# EAGLE schematic HW_RPI_DAQ (EAGLE 9.2.1), part 1 of 2

## Sheet 1 of 8: CM5 MODULE
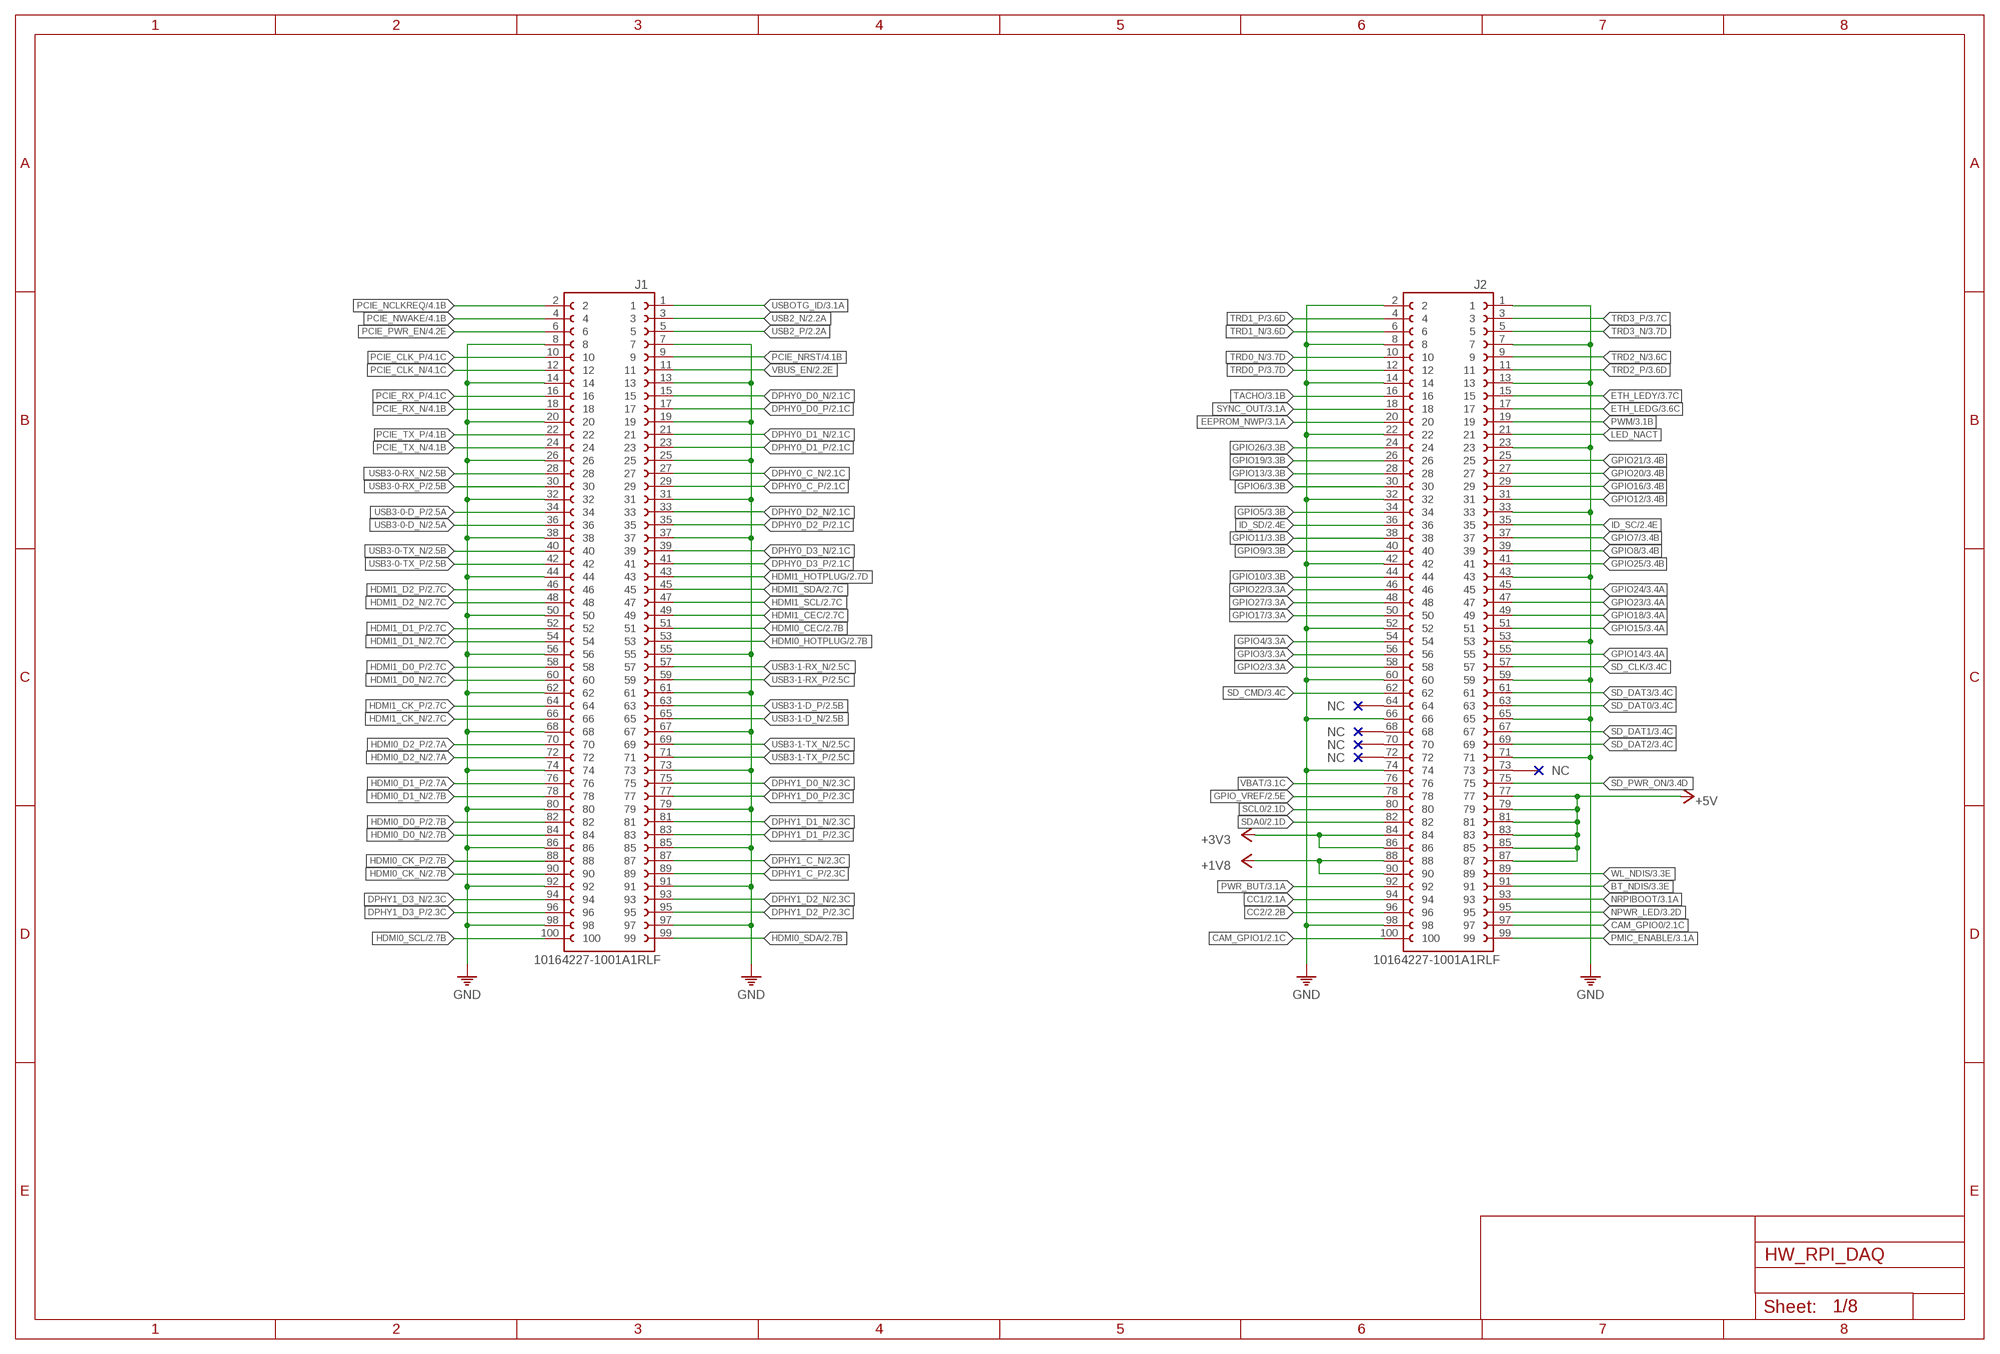
[diagram p0: schematic, sheet 1]

### Parts
J1  10164227-1001A1RLF  [AMPHENOL_10164227-1001A1RLF]
J2  10164227-1001A1RLF  [AMPHENOL_10164227-1001A1RLF]

### Nets
+1V8: J2.88 J2.90 ; also sheet 3
+3V3: J2.84 J2.86 ; also sheet 2,3,4,5,6,7,8
+5V: J2.77 J2.79 J2.81 J2.83 J2.85 J2.87 ; also sheet 2,3,4,7,8
BT_NDIS: J2.91 ; also sheet 3
CAM_GPIO0: J2.97 ; also sheet 2
CAM_GPIO1: J2.100 ; also sheet 2
CC1: J2.94 ; also sheet 2
CC2: J2.96 ; also sheet 2
DPHY0_C_N: J1.27 ; also sheet 2
DPHY0_C_P: J1.29 ; also sheet 2
DPHY0_D0_N: J1.15 ; also sheet 2
DPHY0_D0_P: J1.17 ; also sheet 2
DPHY0_D1_N: J1.21 ; also sheet 2
DPHY0_D1_P: J1.23 ; also sheet 2
DPHY0_D2_N: J1.33 ; also sheet 2
DPHY0_D2_P: J1.35 ; also sheet 2
DPHY0_D3_N: J1.39 ; also sheet 2
DPHY0_D3_P: J1.41 ; also sheet 2
DPHY1_C_N: J1.87 ; also sheet 2
DPHY1_C_P: J1.89 ; also sheet 2
DPHY1_D0_N: J1.75 ; also sheet 2
DPHY1_D0_P: J1.77 ; also sheet 2
DPHY1_D1_N: J1.81 ; also sheet 2
DPHY1_D1_P: J1.83 ; also sheet 2
DPHY1_D2_N: J1.93 ; also sheet 2
DPHY1_D2_P: J1.95 ; also sheet 2
DPHY1_D3_N: J1.94 ; also sheet 2
DPHY1_D3_P: J1.96 ; also sheet 2
EEPROM_NWP: J2.20 ; also sheet 3
ETH_LEDG: J2.17 ; also sheet 3
ETH_LEDY: J2.15 ; also sheet 3
GND: J1.7 J1.8 J1.13 J1.14 J1.19 J1.20 J1.25 J1.26 J1.31 J1.32 J1.37 J1.38 J1.44 J1.50 J1.55 J1.56 J1.61 J1.62 J1.67 J1.68 J1.73 J1.74 J1.79 J1.80 J1.85 J1.86 J1.91 J1.92 J1.97 J1.98 J2.1 J2.2 J2.7 J2.8 J2.13 J2.14 J2.22 J2.23 J2.32 J2.33 J2.42 J2.43 J2.52 J2.53 J2.59 J2.60 J2.65 J2.66 J2.71 J2.74 J2.98 ; also sheet 2,3,4,5,6,7,8
GPIO2: J2.58 ; also sheet 3
GPIO3: J2.56 ; also sheet 3
GPIO4: J2.54 ; also sheet 3,4
GPIO5: J2.34 ; also sheet 3,4
GPIO6: J2.30 ; also sheet 3,4
GPIO7: J2.37 ; also sheet 3,4
GPIO8: J2.39 ; also sheet 3,4
GPIO9: J2.40 ; also sheet 3,4
GPIO10: J2.44 ; also sheet 3,4
GPIO11: J2.38 ; also sheet 3,4
GPIO12: J2.31 ; also sheet 3
GPIO13: J2.28 ; also sheet 3,4
GPIO14: J2.55 ; also sheet 3
GPIO15: J2.51 ; also sheet 3
GPIO16: J2.29 ; also sheet 3,4
GPIO17: J2.50 ; also sheet 3,4
GPIO18: J2.49 ; also sheet 3,4
GPIO19: J2.26 ; also sheet 3,4
GPIO20: J2.27 ; also sheet 3,4
GPIO21: J2.25 ; also sheet 3,4
GPIO22: J2.46 ; also sheet 3
GPIO23: J2.47 ; also sheet 3,4
GPIO24: J2.45 ; also sheet 3,4
GPIO25: J2.41 ; also sheet 3,4
GPIO26: J2.24 ; also sheet 3
GPIO27: J2.48 ; also sheet 3,4
GPIO_VREF: J2.78 ; also sheet 2,3
HDMI0_CEC: J1.51 ; also sheet 2
HDMI0_CK_N [100R_DIFFPAIR]: J1.90 ; also sheet 2
HDMI0_CK_P [100R_DIFFPAIR]: J1.88 ; also sheet 2
HDMI0_D0_N [100R_DIFFPAIR]: J1.84 ; also sheet 2
HDMI0_D0_P [100R_DIFFPAIR]: J1.82 ; also sheet 2
HDMI0_D1_N [100R_DIFFPAIR]: J1.78 ; also sheet 2
HDMI0_D1_P [100R_DIFFPAIR]: J1.76 ; also sheet 2
HDMI0_D2_N [100R_DIFFPAIR]: J1.72 ; also sheet 2
HDMI0_D2_P [100R_DIFFPAIR]: J1.70 ; also sheet 2
HDMI0_HOTPLUG: J1.53 ; also sheet 2
HDMI0_SCL: J1.100 ; also sheet 2
HDMI0_SDA: J1.99 ; also sheet 2
HDMI1_CEC: J1.49 ; also sheet 2
HDMI1_CK_N [100R_DIFFPAIR]: J1.66 ; also sheet 2
HDMI1_CK_P [100R_DIFFPAIR]: J1.64 ; also sheet 2
HDMI1_D0_N [100R_DIFFPAIR]: J1.60 ; also sheet 2
HDMI1_D0_P [100R_DIFFPAIR]: J1.58 ; also sheet 2
HDMI1_D1_N [100R_DIFFPAIR]: J1.54 ; also sheet 2
HDMI1_D1_P [100R_DIFFPAIR]: J1.52 ; also sheet 2
HDMI1_D2_N [100R_DIFFPAIR]: J1.48 ; also sheet 2
HDMI1_D2_P [100R_DIFFPAIR]: J1.46 ; also sheet 2
HDMI1_HOTPLUG: J1.43 ; also sheet 2
HDMI1_SCL: J1.47 ; also sheet 2
HDMI1_SDA: J1.45 ; also sheet 2
ID_SC: J2.35 ; also sheet 2,3
ID_SD: J2.36 ; also sheet 2,3
LED_NACT: J2.21
NPWR_LED: J2.95 ; also sheet 3
NRPIBOOT: J2.93 ; also sheet 3
PCIE_CLK_N: J1.12 ; also sheet 4
PCIE_CLK_P: J1.10 ; also sheet 4
PCIE_NCLKREQ: J1.2 ; also sheet 4
PCIE_NRST: J1.9 ; also sheet 4
PCIE_NWAKE: J1.4 ; also sheet 4
PCIE_PWR_EN: J1.6 ; also sheet 4
PCIE_RX_N: J1.18 ; also sheet 4
PCIE_RX_P: J1.16 ; also sheet 4
PCIE_TX_N: J1.24 ; also sheet 4
PCIE_TX_P: J1.22 ; also sheet 4
PMIC_ENABLE: J2.99 ; also sheet 3
PWM: J2.19 ; also sheet 3
PWR_BUT: J2.92 ; also sheet 3
SCL0: J2.80 ; also sheet 2
SD_CLK: J2.57 ; also sheet 3
SD_CMD: J2.62 ; also sheet 3
SD_DAT0: J2.63 ; also sheet 3
SD_DAT1: J2.67 ; also sheet 3
SD_DAT2: J2.69 ; also sheet 3
SD_DAT3: J2.61 ; also sheet 3
SD_PWR_ON: J2.75 ; also sheet 3
SDA0: J2.82 ; also sheet 2
SYNC_OUT: J2.18 ; also sheet 3
TACHO: J2.16 ; also sheet 3
TRD0_N [100R_DIFFPAIR]: J2.10 ; also sheet 3
TRD0_P [100R_DIFFPAIR]: J2.12 ; also sheet 3
TRD1_N [100R_DIFFPAIR]: J2.6 ; also sheet 3
TRD1_P [100R_DIFFPAIR]: J2.4 ; also sheet 3
TRD2_N [100R_DIFFPAIR]: J2.9 ; also sheet 3
TRD2_P [100R_DIFFPAIR]: J2.11 ; also sheet 3
TRD3_N [100R_DIFFPAIR]: J2.5 ; also sheet 3
TRD3_P [100R_DIFFPAIR]: J2.3 ; also sheet 3
USB2_N [90R_DIFFPAIR]: J1.3 ; also sheet 2
USB2_P [90R_DIFFPAIR]: J1.5 ; also sheet 2
USB3-0-D_N [90R_DIFFPAIR]: J1.36 ; also sheet 2
USB3-0-D_P [90R_DIFFPAIR]: J1.34 ; also sheet 2
USB3-0-RX_N [90R_DIFFPAIR]: J1.28 ; also sheet 2
USB3-0-RX_P [90R_DIFFPAIR]: J1.30 ; also sheet 2
USB3-0-TX_N [90R_DIFFPAIR]: J1.40 ; also sheet 2
USB3-0-TX_P [90R_DIFFPAIR]: J1.42 ; also sheet 2
USB3-1-D_N [90R_DIFFPAIR]: J1.65 ; also sheet 2
USB3-1-D_P [90R_DIFFPAIR]: J1.63 ; also sheet 2
USB3-1-RX_N [90R_DIFFPAIR]: J1.57 ; also sheet 2
USB3-1-RX_P [90R_DIFFPAIR]: J1.59 ; also sheet 2
USB3-1-TX_N [90R_DIFFPAIR]: J1.69 ; also sheet 2
USB3-1-TX_P [90R_DIFFPAIR]: J1.71 ; also sheet 2
USBOTG_ID: J1.1 ; also sheet 3
VBAT: J2.76 ; also sheet 3
VBUS_EN: J1.11 ; also sheet 2
WL_NDIS: J2.89 ; also sheet 3
Unconnected: J2.64 J2.68 J2.70 J2.72 J2.73

## Sheet 2 of 8: CM5 HIGH SPEED INTERFACES
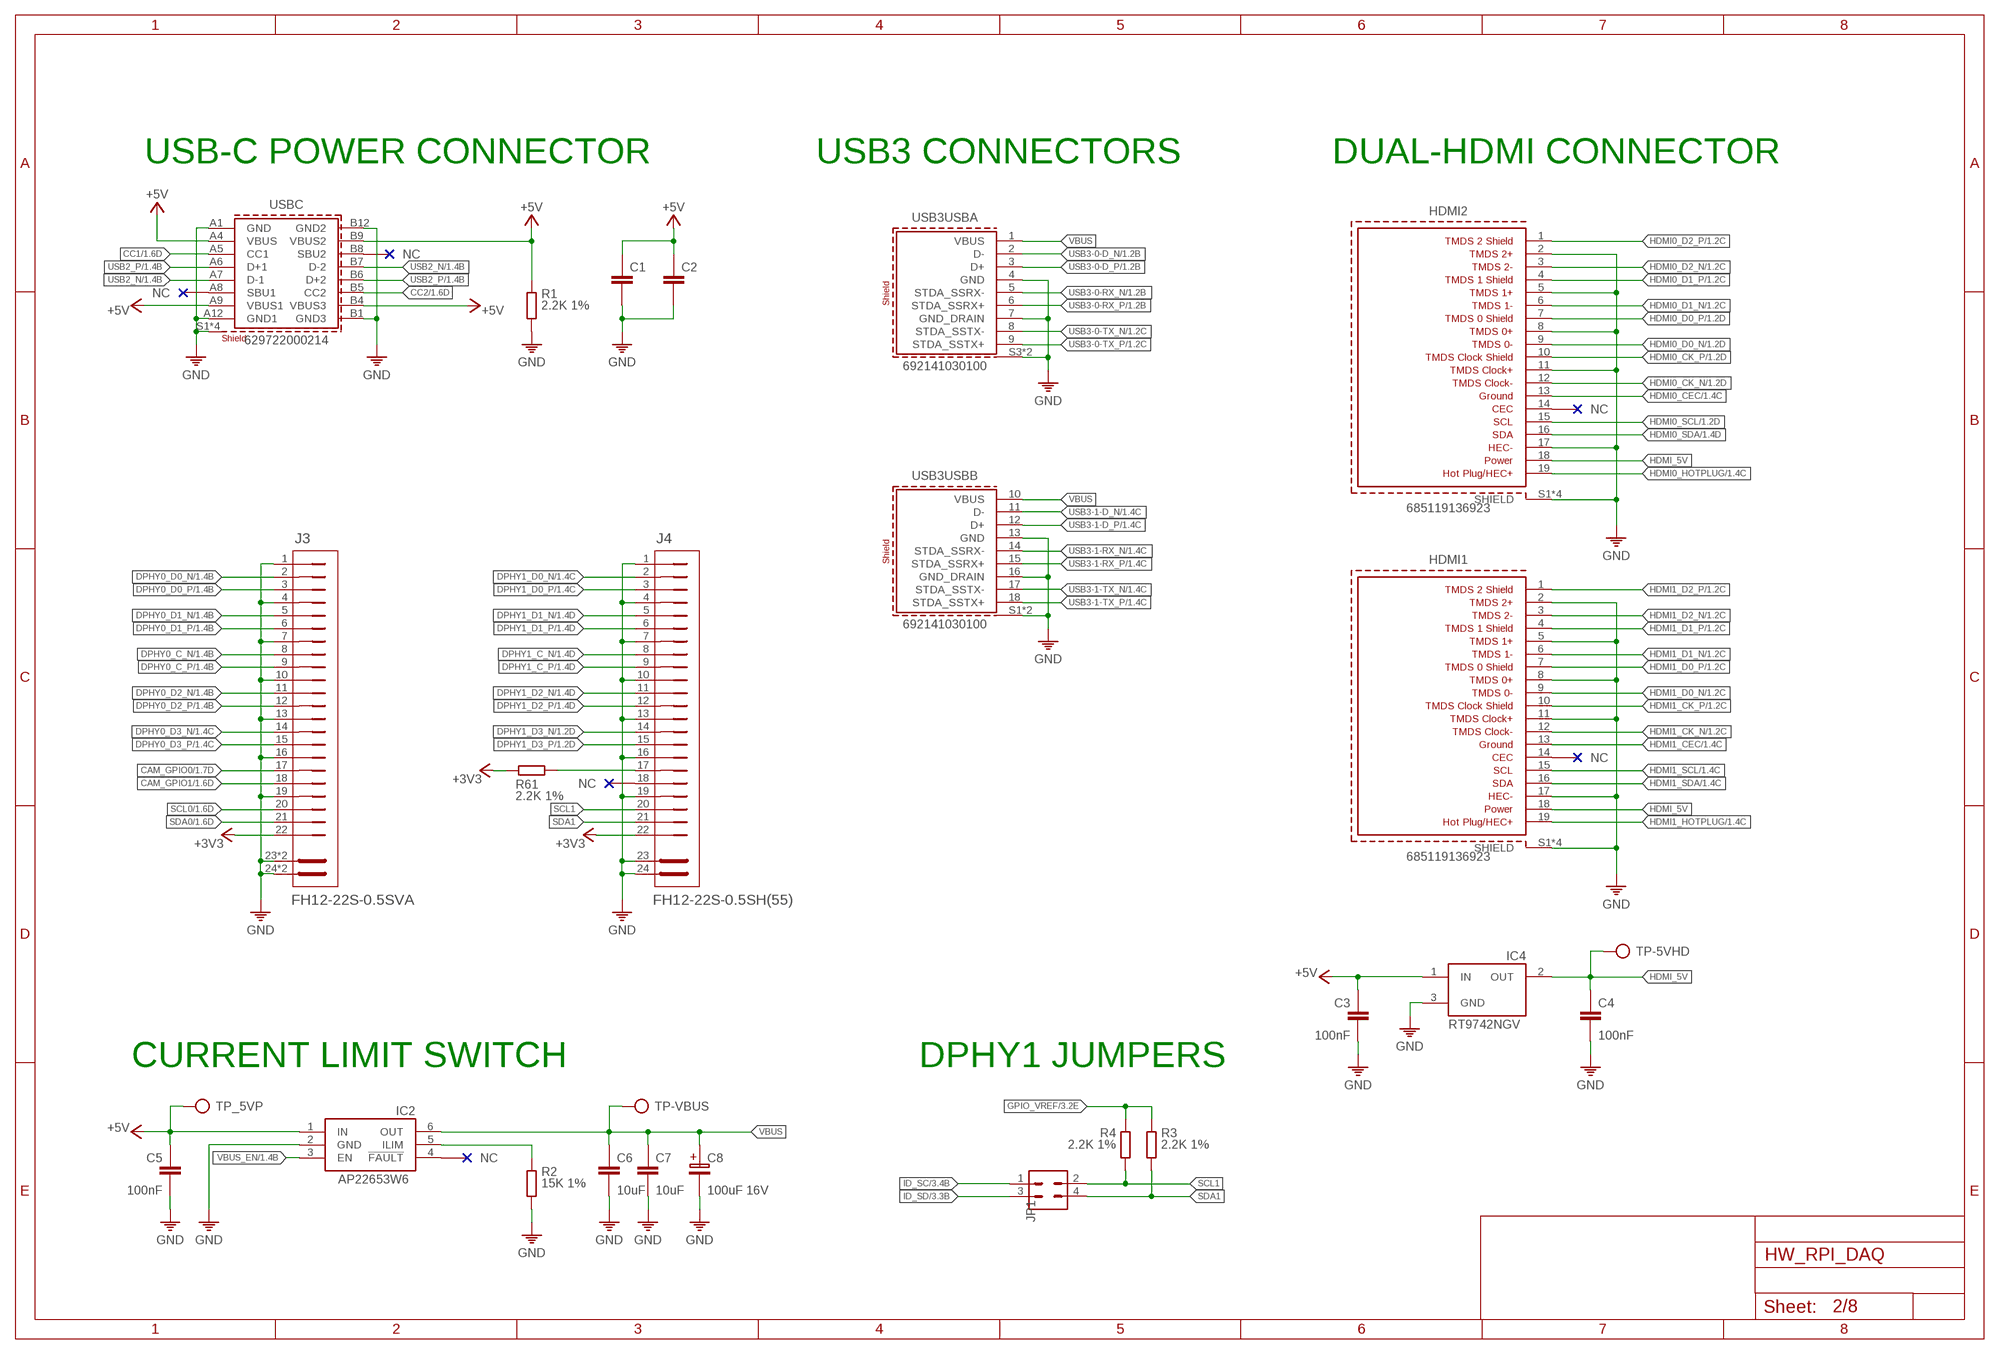
[diagram p1: schematic, sheet 2]

### Parts
C1  C0402  [0402]
C2  C0402  [0402]
C3  100nF  C0402  [0402]
C4  100nF  C0402  [0402]
C5  100nF  C0402  [0402]
C6  10uF  C0805  [0805]
C7  10uF  C0805  [0805]
C8  100uF 16V  CPOL  [100UF-16V]
HDMI1  685119136923  [685119136923]
HDMI2  685119136923  [685119136923]
IC2  AP22653W6  [SOT23-6]
IC4  RT9742NGV  [SOT23]
J3  FH12-22S-0.5SVA  [FH12-22S-0.5SH]
J4  FH12-22S-0.5SH(55)  [CONN_FH12-22S-0.5SH(55)_HIR]
JP1  CON-2X2  [2X2]
R1  2.2K 1%  R0402  [0402]
R2  15K 1%  R0402  [0402]
R3  2.2K 1%  R0402  [0402]
R4  2.2K 1%  R0402  [0402]
R61  2.2K 1%  R0402  [0402]
TP-5VHD  TP  [TP]
TP-VBUS  TP  [TP]
TP_5VP  TP  [TP]
USB3  692141030100  [692141030100]
USBC  629722000214  [629722000214]

### Nets
+3V3: J3.22 J4.22 R61.2 ; also sheet 1,3,4,5,6,7,8
+5V: C1.1 C2.1 C3.1 C5.1 IC2.1(IN) IC4.1(IN) R1.1 TP_5VP.TP USBC.A4(VBUS) USBC.A9(VBUS1) USBC.B4(VBUS3) USBC.B9(VBUS2) ; also sheet 1,3,4,7,8
CAM_GPIO0: J3.17 ; also sheet 1
CAM_GPIO1: J3.18 ; also sheet 1
CC1: USBC.A5(CC1) ; also sheet 1
CC2: USBC.B5(CC2) ; also sheet 1
DPHY0_C_N: J3.8 ; also sheet 1
DPHY0_C_P: J3.9 ; also sheet 1
DPHY0_D0_N: J3.2 ; also sheet 1
DPHY0_D0_P: J3.3 ; also sheet 1
DPHY0_D1_N: J3.5 ; also sheet 1
DPHY0_D1_P: J3.6 ; also sheet 1
DPHY0_D2_N: J3.11 ; also sheet 1
DPHY0_D2_P: J3.12 ; also sheet 1
DPHY0_D3_N: J3.14 ; also sheet 1
DPHY0_D3_P: J3.15 ; also sheet 1
DPHY1_C_N: J4.8 ; also sheet 1
DPHY1_C_P: J4.9 ; also sheet 1
DPHY1_D0_N: J4.2 ; also sheet 1
DPHY1_D0_P: J4.3 ; also sheet 1
DPHY1_D1_N: J4.5 ; also sheet 1
DPHY1_D1_P: J4.6 ; also sheet 1
DPHY1_D2_N: J4.11 ; also sheet 1
DPHY1_D2_P: J4.12 ; also sheet 1
DPHY1_D3_N: J4.14 ; also sheet 1
DPHY1_D3_P: J4.15 ; also sheet 1
GND: C1.2 C2.2 C3.2 C4.2 C5.2 C6.2 C7.2 C8.2 HDMI1.2(TMDS2+) HDMI1.5(TMDSDATA1+) HDMI1.8(TMDS0+) HDMI1.11(TMDSCLOCK+) HDMI1.17(UTILITY/HEAC+) HDMI1.S1(SHIELD) HDMI1.S2(SHIELD) HDMI1.S3(SHIELD) HDMI1.S4(SHIELD) HDMI2.2(TMDS2+) HDMI2.5(TMDSDATA1+) HDMI2.8(TMDS0+) HDMI2.11(TMDSCLOCK+) HDMI2.17(UTILITY/HEAC+) HDMI2.S1(SHIELD) HDMI2.S2(SHIELD) HDMI2.S3(SHIELD) HDMI2.S4(SHIELD) IC2.2(GND) IC4.3(GND) J3.1 J3.4 J3.7 J3.10 J3.13 J3.16 J3.19 J3.23(MH1) J3.24(MH2) J3.25(MH1) J3.26(MH2) J4.1 J4.4 J4.7 J4.10 J4.13 J4.16 J4.19 J4.23(MH1) J4.24(MH2) R1.2 R2.2 USB3.4(USBA:GND) USB3.7(USBA:GND_DRAIN) USB3.13(USBB:GND) USB3.16(USBB:GND_DRAIN) USB3.S1(USBB:SHIELD) USB3.S2(USBB:SHIELD) USB3.S3(USBA:SHIELD) USB3.S4(USBA:SHIELD) USBC.A1(GND) USBC.A12(GND1) USBC.B1(GND3) USBC.B12(GND2) USBC.S1(SHIELD) USBC.S2(SHIELD) USBC.S3(SHIELD) USBC.S4(SHIELD) ; also sheet 1,3,4,5,6,7,8
GPIO_VREF: R3.1 R4.1 ; also sheet 1,3
HDMI0_CEC: HDMI2.13(GROUND) ; also sheet 1
HDMI0_CK_N [100R_DIFFPAIR]: HDMI2.12(TMDSCLOCK-) ; also sheet 1
HDMI0_CK_P [100R_DIFFPAIR]: HDMI2.10(TMDSCLOCKSHIELD) ; also sheet 1
HDMI0_D0_N [100R_DIFFPAIR]: HDMI2.9(TMDS0-) ; also sheet 1
HDMI0_D0_P [100R_DIFFPAIR]: HDMI2.7(TMDS0SHIELD) ; also sheet 1
HDMI0_D1_N [100R_DIFFPAIR]: HDMI2.6(TMDS1-) ; also sheet 1
HDMI0_D1_P [100R_DIFFPAIR]: HDMI2.4(TMDS1SHIELD) ; also sheet 1
HDMI0_D2_N [100R_DIFFPAIR]: HDMI2.3(TMDS2-) ; also sheet 1
HDMI0_D2_P [100R_DIFFPAIR]: HDMI2.1(TMDS2SHIELD) ; also sheet 1
HDMI0_HOTPLUG: HDMI2.19(HOTPLUG/HEC+) ; also sheet 1
HDMI0_SCL: HDMI2.15(SCL) ; also sheet 1
HDMI0_SDA: HDMI2.16(SDA) ; also sheet 1
HDMI1_CEC: HDMI1.13(GROUND) ; also sheet 1
HDMI1_CK_N [100R_DIFFPAIR]: HDMI1.12(TMDSCLOCK-) ; also sheet 1
HDMI1_CK_P [100R_DIFFPAIR]: HDMI1.10(TMDSCLOCKSHIELD) ; also sheet 1
HDMI1_D0_N [100R_DIFFPAIR]: HDMI1.9(TMDS0-) ; also sheet 1
HDMI1_D0_P [100R_DIFFPAIR]: HDMI1.7(TMDS0SHIELD) ; also sheet 1
HDMI1_D1_N [100R_DIFFPAIR]: HDMI1.6(TMDS1-) ; also sheet 1
HDMI1_D1_P [100R_DIFFPAIR]: HDMI1.4(TMDS1SHIELD) ; also sheet 1
HDMI1_D2_N [100R_DIFFPAIR]: HDMI1.3(TMDS2-) ; also sheet 1
HDMI1_D2_P [100R_DIFFPAIR]: HDMI1.1(TMDS2SHIELD) ; also sheet 1
HDMI1_HOTPLUG: HDMI1.19(HOTPLUG/HEC+) ; also sheet 1
HDMI1_SCL: HDMI1.15(SCL) ; also sheet 1
HDMI1_SDA: HDMI1.16(SDA) ; also sheet 1
HDMI_5V: C4.1 HDMI1.18(POWER) HDMI2.18(POWER) IC4.2(OUT) TP-5VHD.TP
ID_SC: JP1.1 ; also sheet 1,3
ID_SD: JP1.3 ; also sheet 1,3
N$1: IC2.5(ILIM) R2.1
N$45: J4.17 R61.1
SCL0: J3.20 ; also sheet 1
SCL1: J4.20 JP1.2 R4.2
SDA0: J3.21 ; also sheet 1
SDA1: J4.21 JP1.4 R3.2
USB2_N [90R_DIFFPAIR]: USBC.A7(D-1) USBC.B7(D-2) ; also sheet 1
USB2_P [90R_DIFFPAIR]: USBC.A6(D+1) USBC.B6(D+2) ; also sheet 1
USB3-0-D_N [90R_DIFFPAIR]: USB3.2(USBA:D-) ; also sheet 1
USB3-0-D_P [90R_DIFFPAIR]: USB3.3(USBA:D+) ; also sheet 1
USB3-0-RX_N [90R_DIFFPAIR]: USB3.5(USBA:STDA_SSRX-) ; also sheet 1
USB3-0-RX_P [90R_DIFFPAIR]: USB3.6(USBA:STDA_SSRX+) ; also sheet 1
USB3-0-TX_N [90R_DIFFPAIR]: USB3.8(USBA:STDA_SSTX-) ; also sheet 1
USB3-0-TX_P [90R_DIFFPAIR]: USB3.9(USBA:STDA_SSTX+) ; also sheet 1
USB3-1-D_N [90R_DIFFPAIR]: USB3.11(USBB:D-) ; also sheet 1
USB3-1-D_P [90R_DIFFPAIR]: USB3.12(USBB:D+) ; also sheet 1
USB3-1-RX_N [90R_DIFFPAIR]: USB3.14(USBB:STDA_SSRX-) ; also sheet 1
USB3-1-RX_P [90R_DIFFPAIR]: USB3.15(USBB:STDA_SSRX+) ; also sheet 1
USB3-1-TX_N [90R_DIFFPAIR]: USB3.17(USBB:STDA_SSTX-) ; also sheet 1
USB3-1-TX_P [90R_DIFFPAIR]: USB3.18(USBB:STDA_SSTX+) ; also sheet 1
VBUS: C6.1 C7.1 C8.1 IC2.6(OUT) TP-VBUS.TP USB3.1(USBA:VBUS) USB3.10(USBB:VBUS)
VBUS_EN: IC2.3(EN) ; also sheet 1
Unconnected: HDMI1.14(CEC) HDMI2.14(CEC) IC2.4(!FAULT) J4.18 USBC.A8(SBU1) USBC.B8(SBU2)

### Notes on the sheet
- USB-C POWER CONNECTOR | USB3 CONNECTORS | DUAL-HDMI CONNECTOR
- CURRENT LIMIT SWITCH | DPHY1 JUMPERS

## Sheet 3 of 8: CM5 GPIO INTERFACES, ETHERNET
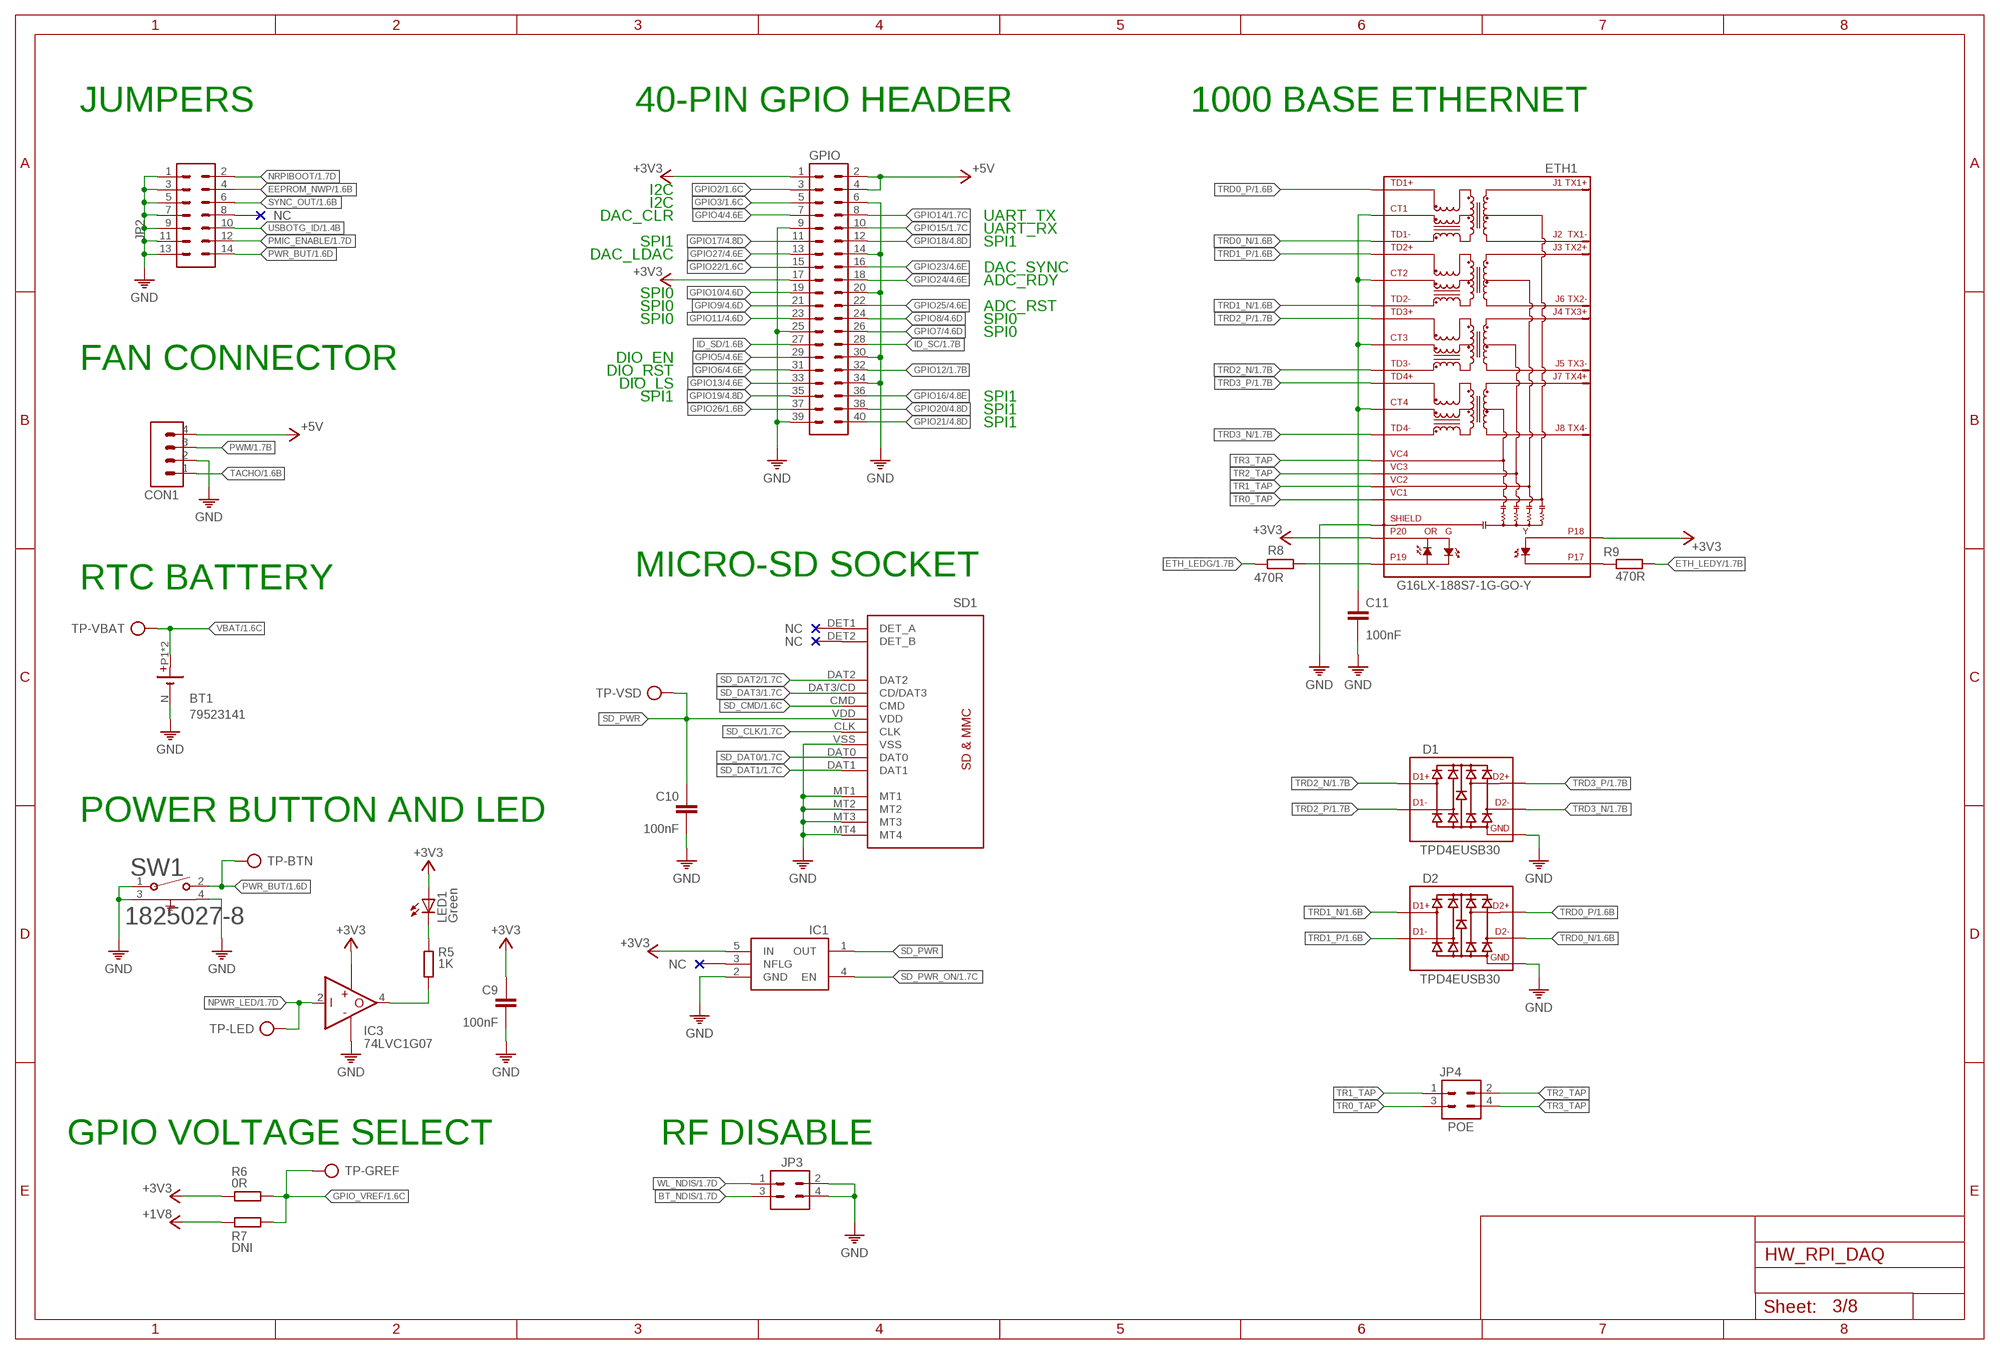
[diagram p2: schematic, sheet 3]

### Parts
BT1  79523141  [79523141]
C9  100nF  C0402  [0402]
C10  100nF  C0402  [0402]
C11  100nF  C0402  [0402]
CON1  CON-1X4  [1X4]
D1  TPD4EUSB30  [USON]
D2  TPD4EUSB30  [USON]
ETH1  G16LX-188S7-1G-GO-Y  MAGJACK-POE  [MAGJACK_POE]
GPIO  CON-2X20  [2X20]
IC1  RT9742GGJ5  [SOT23-5]
IC3  74LVC1G07  [SOT23-5]
JP2  CON-2X7  [2X7]
JP3  CON-2X2  [2X2]
JP4  POE  CON-2X2  [2X2]
LED1  Green  LEDCHIPLED_0805  [CHIPLED_0805]
R5  1K  R0402  [0402]
R6  0R  R0402  [0402]
R7  DNI  R0402  [0402]
R8  470R  R0402  [0402]
R9  470R  R0402  [0402]
SD1  MICRO-SD  [MICROSD]
SW1  1825027-8  [SW2_1825027-C_TEC]
TP-BTN  TP  [TP]
TP-GREF  TP  [TP]
TP-LED  TP  [TP]
TP-VBAT  TP  [TP]
TP-VSD  TP  [TP]

### Nets
+1V8: R7.1 ; also sheet 1
+3V3: C9.1 ETH1.18 ETH1.20 GPIO.1 GPIO.17 IC1.5(IN) IC3.5(VCC) LED1.A R6.1 ; also sheet 1,2,4,5,6,7,8
+5V: CON1.4 GPIO.2 GPIO.4 ; also sheet 1,2,4,7,8
BT_NDIS: JP3.3 ; also sheet 1
EEPROM_NWP: JP2.4 ; also sheet 1
ETH_LEDG: R8.1 ; also sheet 1
ETH_LEDY: R9.2 ; also sheet 1
GND: BT1.N(-) C9.2 C10.2 C11.2 CON1.2 D1.3(GND) D1.8(GND) D2.3(GND) D2.8(GND) ETH1.MH3(SHIELD) ETH1.MH4(SHIELD) GPIO.6 GPIO.9 GPIO.14 GPIO.20 GPIO.25 GPIO.30 GPIO.34 GPIO.39 IC1.2(GND) IC3.3(GND) JP2.1 JP2.3 JP2.5 JP2.7 JP2.9 JP2.11 JP2.13 JP3.2 JP3.4 SD1.MT1 SD1.MT2 SD1.MT3 SD1.MT4 SD1.VSS SW1.1 SW1.3 SW1.4 ; also sheet 1,2,4,5,6,7,8
GPIO2: GPIO.3 ; also sheet 1
GPIO3: GPIO.5 ; also sheet 1
GPIO4: GPIO.7 ; also sheet 1,4
GPIO5: GPIO.29 ; also sheet 1,4
GPIO6: GPIO.31 ; also sheet 1,4
GPIO7: GPIO.26 ; also sheet 1,4
GPIO8: GPIO.24 ; also sheet 1,4
GPIO9: GPIO.21 ; also sheet 1,4
GPIO10: GPIO.19 ; also sheet 1,4
GPIO11: GPIO.23 ; also sheet 1,4
GPIO12: GPIO.32 ; also sheet 1
GPIO13: GPIO.33 ; also sheet 1,4
GPIO14: GPIO.8 ; also sheet 1
GPIO15: GPIO.10 ; also sheet 1
GPIO16: GPIO.36 ; also sheet 1,4
GPIO17: GPIO.11 ; also sheet 1,4
GPIO18: GPIO.12 ; also sheet 1,4
GPIO19: GPIO.35 ; also sheet 1,4
GPIO20: GPIO.38 ; also sheet 1,4
GPIO21: GPIO.40 ; also sheet 1,4
GPIO22: GPIO.15 ; also sheet 1
GPIO23: GPIO.16 ; also sheet 1,4
GPIO24: GPIO.18 ; also sheet 1,4
GPIO25: GPIO.22 ; also sheet 1,4
GPIO26: GPIO.37 ; also sheet 1
GPIO27: GPIO.13 ; also sheet 1,4
GPIO_VREF: R6.2 R7.2 TP-GREF.TP ; also sheet 1,2
ID_SC: GPIO.28 ; also sheet 1,2
ID_SD: GPIO.27 ; also sheet 1,2
N$2: LED1.C R5.1
N$3: IC3.4(Y) R5.2
N$4: C11.1 ETH1.CT1 ETH1.CT2 ETH1.CT3 ETH1.CT4
N$5: ETH1.17 R9.1
N$8: ETH1.19 R8.2
NPWR_LED: IC3.2(A) TP-LED.TP ; also sheet 1
NRPIBOOT: JP2.2 ; also sheet 1
PMIC_ENABLE: JP2.12 ; also sheet 1
PWM: CON1.3 ; also sheet 1
PWR_BUT: JP2.14 SW1.2 TP-BTN.TP ; also sheet 1
SD_CLK: SD1.CLK ; also sheet 1
SD_CMD: SD1.CMD ; also sheet 1
SD_DAT0: SD1.DAT0 ; also sheet 1
SD_DAT1: SD1.DAT1 ; also sheet 1
SD_DAT2: SD1.DAT2 ; also sheet 1
SD_DAT3: SD1.DAT3/CD(CD/DAT3) ; also sheet 1
SD_PWR: C10.1 IC1.1(OUT) SD1.VDD TP-VSD.TP
SD_PWR_ON: IC1.4(EN) ; also sheet 1
SYNC_OUT: JP2.6 ; also sheet 1
TACHO: CON1.1 ; also sheet 1
TR0_TAP: ETH1.VC1 JP4.3
TR1_TAP: ETH1.VC2 JP4.1
TR2_TAP: ETH1.VC3 JP4.2
TR3_TAP: ETH1.VC4 JP4.4
TRD0_N [100R_DIFFPAIR]: D2.2(D1-) D2.9(D1-) ETH1.TD1- ; also sheet 1
TRD0_P [100R_DIFFPAIR]: D2.1(D1+) D2.10(D1+) ETH1.TD1+ ; also sheet 1
TRD1_N [100R_DIFFPAIR]: D2.4(D2+) D2.7(D2+) ETH1.TD2- ; also sheet 1
TRD1_P [100R_DIFFPAIR]: D2.5(D2-) D2.6(D2-) ETH1.TD2+ ; also sheet 1
TRD2_N [100R_DIFFPAIR]: D1.4(D2+) D1.7(D2+) ETH1.TD3- ; also sheet 1
TRD2_P [100R_DIFFPAIR]: D1.5(D2-) D1.6(D2-) ETH1.TD3+ ; also sheet 1
TRD3_N [100R_DIFFPAIR]: D1.2(D1-) D1.9(D1-) ETH1.TD4- ; also sheet 1
TRD3_P [100R_DIFFPAIR]: D1.1(D1+) D1.10(D1+) ETH1.TD4+ ; also sheet 1
USBOTG_ID: JP2.10 ; also sheet 1
VBAT: BT1.P1(+) BT1.P2(+) TP-VBAT.TP ; also sheet 1
WL_NDIS: JP3.1 ; also sheet 1
Unconnected: IC1.3(NFLG) JP2.8 SD1.DET1(DET_A) SD1.DET2(DET_B)

### Notes on the sheet
- JUMPERS | 40-PIN GPIO HEADER | 1000 BASE ETHERNET
- I2C
- I2C
- DAC_CLR | UART_TX
- UART_RX
- SPI1 | SPI1
- DAC_LDAC
- DAC_SYNC
- ADC_RDY
- SPI0
- SPI0 | ADC_RST
- SPI0 | SPI0
- SPI0
- DIO_EN
- FAN CONNECTOR | DIO_RST
- DIO_LS
- SPI1 | SPI1
- SPI1
- SPI1
- MICRO-SD SOCKET
- RTC BATTERY
- POWER BUTTON AND LED
- GPIO VOLTAGE SELECT | RF DISABLE

## Sheet 4 of 8: CM5 PCIE-M2 INTERFACE
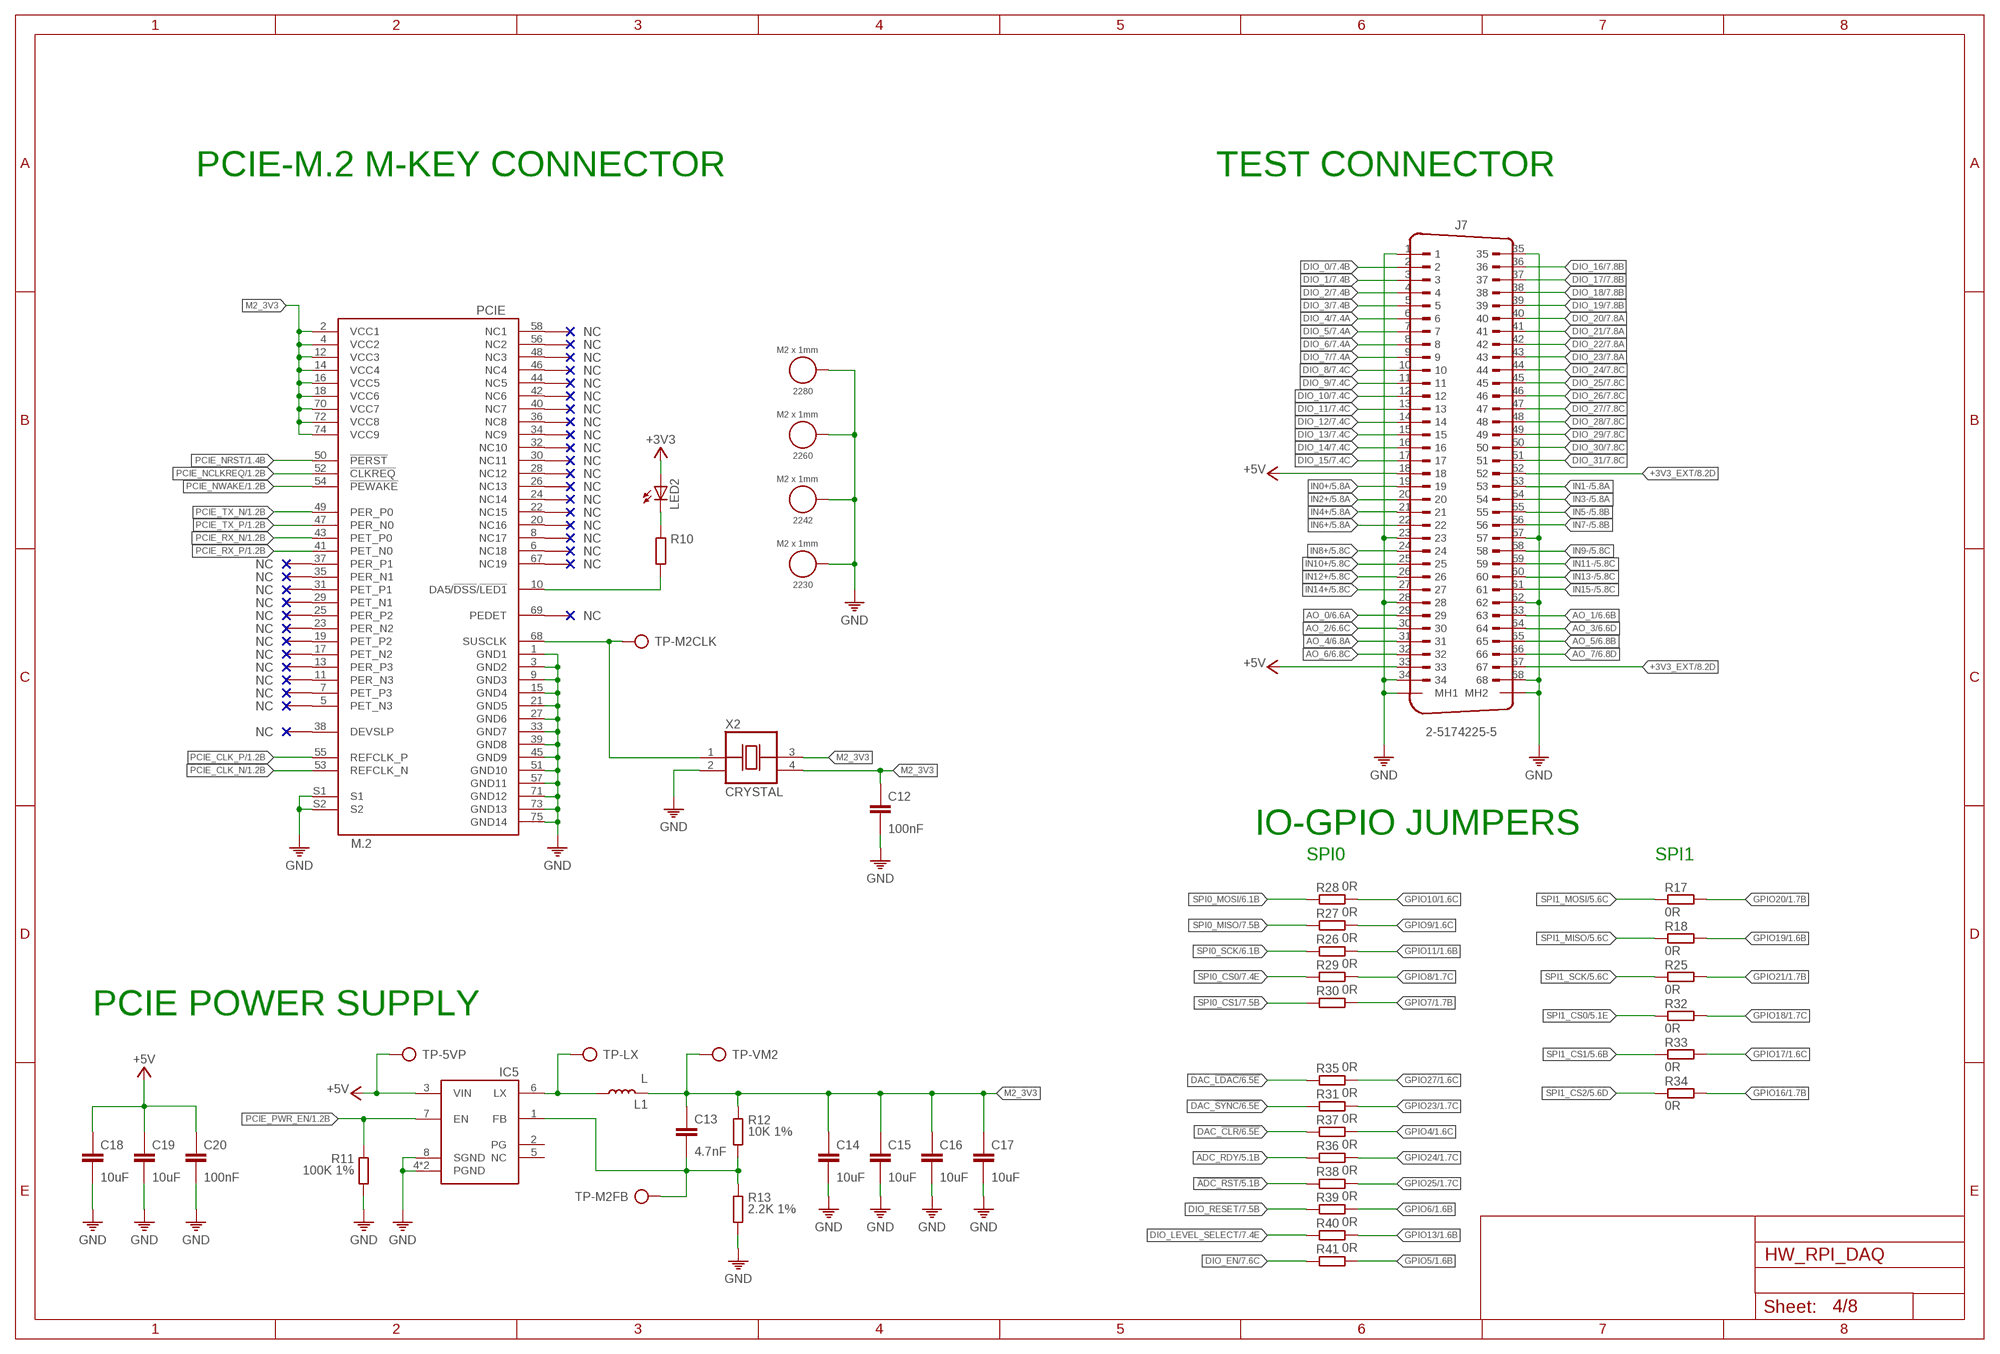
[diagram p3: schematic, sheet 4]

### Parts
2230  M2 x 1mm  WA-SMSI_9774XXX243_9774010243  [WA-SMSI_9774010243]
2242  M2 x 1mm  WA-SMSI_9774XXX243_9774010243  [WA-SMSI_9774010243]
2260  M2 x 1mm  WA-SMSI_9774XXX243_9774010243  [WA-SMSI_9774010243]
2280  M2 x 1mm  WA-SMSI_9774XXX243_9774010243  [WA-SMSI_9774010243]
C12  100nF  C0402  [0402]
C13  4.7nF  C0402  [0402]
C14  10uF  C0805  [0805]
C15  10uF  C0805  [0805]
C16  10uF  C0805  [0805]
C17  10uF  C0805  [0805]
C18  10uF  C0805  [0805]
C19  10uF  C0805  [0805]
C20  100nF  C0402  [0402]
IC5  AP3441SHE-7B  [SON50P201X201X56-9T90X170N]
J7  2-5174225-5  [2-5174225-5]
L1  L  [SRR5228A]
LED2  LEDCHIPLED_0805  [CHIPLED_0805]
PCIE  M.2  [M.2]
R10  R0402  [0402]
R11  100K 1%  R0402  [0402]
R12  10K 1%  R0402  [0402]
R13  2.2K 1%  R0402  [0402]
R17  0R  R0603  [0603]
R18  0R  R0603  [0603]
R25  0R  R0603  [0603]
R26  0R  R0603  [0603]
R27  0R  R0603  [0603]
R28  0R  R0603  [0603]
R29  0R  R0603  [0603]
R30  0R  R0603  [0603]
R31  0R  R0603  [0603]
R32  0R  R0603  [0603]
R33  0R  R0603  [0603]
R34  0R  R0603  [0603]
R35  0R  R0603  [0603]
R36  0R  R0603  [0603]
R37  0R  R0603  [0603]
R38  0R  R0603  [0603]
R39  0R  R0603  [0603]
R40  0R  R0603  [0603]
R41  0R  R0603  [0603]
TP-5VP  TP  [TP]
TP-LX  TP  [TP]
TP-M2CLK  TP  [TP]
TP-M2FB  TP  [TP]
TP-VM2  TP  [TP]
X2  CRYSTAL  [OSCCC500X320X130]

### Nets
!ADC_RST: R38.1 ; also sheet 5
+3V3: LED2.A ; also sheet 1,2,3,5,6,7,8
+3V3_EXT: J7.52 J7.67 ; also sheet 8
+5V: C18.1 C19.1 C20.1 IC5.3(VIN) J7.18 J7.33 TP-5VP.TP ; also sheet 1,2,3,7,8
ADC_RDY: R36.1 ; also sheet 5
AO_0: J7.29 ; also sheet 6
AO_1: J7.63 ; also sheet 6
AO_2: J7.30 ; also sheet 6
AO_3: J7.64 ; also sheet 6
AO_4: J7.31 ; also sheet 6
AO_5: J7.65 ; also sheet 6
AO_6: J7.32 ; also sheet 6
AO_7: J7.66 ; also sheet 6
DAC_!CLR: R37.1 ; also sheet 6
DAC_!LDAC: R35.1 ; also sheet 6
DAC_!SYNC: R31.1 ; also sheet 6
DIO_0: J7.2 ; also sheet 7
DIO_1: J7.3 ; also sheet 7
DIO_2: J7.4 ; also sheet 7
DIO_3: J7.5 ; also sheet 7
DIO_4: J7.6 ; also sheet 7
DIO_5: J7.7 ; also sheet 7
DIO_6: J7.8 ; also sheet 7
DIO_7: J7.9 ; also sheet 7
DIO_8: J7.10 ; also sheet 7
DIO_9: J7.11 ; also sheet 7
DIO_10: J7.12 ; also sheet 7
DIO_11: J7.13 ; also sheet 7
DIO_12: J7.14 ; also sheet 7
DIO_13: J7.15 ; also sheet 7
DIO_14: J7.16 ; also sheet 7
DIO_15: J7.17 ; also sheet 7
DIO_16: J7.36 ; also sheet 7
DIO_17: J7.37 ; also sheet 7
DIO_18: J7.38 ; also sheet 7
DIO_19: J7.39 ; also sheet 7
DIO_20: J7.40 ; also sheet 7
DIO_21: J7.41 ; also sheet 7
DIO_22: J7.42 ; also sheet 7
DIO_23: J7.43 ; also sheet 7
DIO_24: J7.44 ; also sheet 7
DIO_25: J7.45 ; also sheet 7
DIO_26: J7.46 ; also sheet 7
DIO_27: J7.47 ; also sheet 7
DIO_28: J7.48 ; also sheet 7
DIO_29: J7.49 ; also sheet 7
DIO_30: J7.50 ; also sheet 7
DIO_31: J7.51 ; also sheet 7
DIO_EN: R41.1 ; also sheet 7
DIO_LEVEL_SELECT: R40.1 ; also sheet 7
DIO_RESET: R39.1 ; also sheet 7
GND: 2230.1 2242.1 2260.1 2280.1 C12.2 C14.2 C15.2 C16.2 C17.2 C18.2 C19.2 C20.2 IC5.4(PGND) IC5.8(SGND) IC5.9(PGND) J7.1 J7.23 J7.28 J7.34 J7.35 J7.57 J7.62 J7.68 J7.MH1 J7.MH2 PCIE.1(GND1) PCIE.3(GND2) PCIE.9(GND3) PCIE.15(GND4) PCIE.21(GND5) PCIE.27(GND6) PCIE.33(GND7) PCIE.39(GND8) PCIE.45(GND9) PCIE.51(GND10) PCIE.57(GND11) PCIE.71(GND12) PCIE.73(GND13) PCIE.75(GND14) PCIE.S1 PCIE.S2 R11.2 R13.2 X2.2(VSS) ; also sheet 1,2,3,5,6,7,8
GPIO4: R37.2 ; also sheet 1,3
GPIO5: R41.2 ; also sheet 1,3
GPIO6: R39.2 ; also sheet 1,3
GPIO7: R30.2 ; also sheet 1,3
GPIO8: R29.2 ; also sheet 1,3
GPIO9: R27.2 ; also sheet 1,3
GPIO10: R28.2 ; also sheet 1,3
GPIO11: R26.2 ; also sheet 1,3
GPIO13: R40.2 ; also sheet 1,3
GPIO16: R34.2 ; also sheet 1,3
GPIO17: R33.2 ; also sheet 1,3
GPIO18: R32.2 ; also sheet 1,3
GPIO19: R18.2 ; also sheet 1,3
GPIO20: R17.2 ; also sheet 1,3
GPIO21: R25.2 ; also sheet 1,3
GPIO23: R31.2 ; also sheet 1,3
GPIO24: R36.2 ; also sheet 1,3
GPIO25: R38.2 ; also sheet 1,3
GPIO27: R35.2 ; also sheet 1,3
IN0+: J7.19 ; also sheet 5
IN1-: J7.53 ; also sheet 5
IN2+: J7.20 ; also sheet 5
IN3-: J7.54 ; also sheet 5
IN4+: J7.21 ; also sheet 5
IN5-: J7.55 ; also sheet 5
IN6+: J7.22 ; also sheet 5
IN7-: J7.56 ; also sheet 5
IN8+: J7.24 ; also sheet 5
IN9-: J7.58 ; also sheet 5
IN10+: J7.25 ; also sheet 5
IN11-: J7.59 ; also sheet 5
IN12+: J7.26 ; also sheet 5
IN13-: J7.60 ; also sheet 5
IN14+: J7.27 ; also sheet 5
IN15-: J7.61 ; also sheet 5
M2_3V3: C12.1 C13.1 C14.1 C15.1 C16.1 C17.1 L1.2 PCIE.2(VCC1) PCIE.4(VCC2) PCIE.12(VCC3) PCIE.14(VCC4) PCIE.16(VCC5) PCIE.18(VCC6) PCIE.70(VCC7) PCIE.72(VCC8) PCIE.74(VCC9) R12.1 TP-VM2.TP X2.3(OUT) X2.4(VDD)
N$6: PCIE.10(DA5/!DSS!/!LED1) R10.2
N$7: LED2.C R10.1
N$9: IC5.6(LX) L1.1 TP-LX.TP
N$10: C13.2 IC5.1(FB) R12.2 R13.1 TP-M2FB.TP
N$11: PCIE.68(SUSCLK) TP-M2CLK.TP X2.1(CON)
PCIE_CLK_N: PCIE.53(REFCLK_N) ; also sheet 1
PCIE_CLK_P: PCIE.55(REFCLK_P) ; also sheet 1
PCIE_NCLKREQ: PCIE.52(!CLKREQ) ; also sheet 1
PCIE_NRST: PCIE.50(!PERST) ; also sheet 1
PCIE_NWAKE: PCIE.54(!PEWAKE) ; also sheet 1
PCIE_PWR_EN: IC5.7(EN) R11.1 ; also sheet 1
PCIE_RX_N: PCIE.43(PET_P0) ; also sheet 1
PCIE_RX_P: PCIE.41(PET_N0) ; also sheet 1
PCIE_TX_N: PCIE.49(PER_P0) ; also sheet 1
PCIE_TX_P: PCIE.47(PER_N0) ; also sheet 1
SPI0_CS0: R29.1 ; also sheet 7
SPI0_CS1: R30.1 ; also sheet 7
SPI0_MISO: R27.1 ; also sheet 7
SPI0_MOSI: R28.1 ; also sheet 6,7
SPI0_SCK: R26.1 ; also sheet 6,7
SPI1_CS0: R32.1 ; also sheet 5
SPI1_CS1: R33.1 ; also sheet 5
SPI1_CS2: R34.1 ; also sheet 5
SPI1_MISO: R18.1 ; also sheet 5
SPI1_MOSI: R17.1 ; also sheet 5
SPI1_SCK: R25.1 ; also sheet 5
Unconnected: IC5.2(PG) IC5.5(NC) PCIE.5(PET_N3) PCIE.6(NC18) PCIE.7(PET_P3) PCIE.8(NC17) PCIE.11(PER_N3) PCIE.13(PER_P3) PCIE.17(PET_N2) PCIE.19(PET_P2) PCIE.20(NC16) PCIE.22(NC15) PCIE.23(PER_N2) PCIE.24(NC14) PCIE.25(PER_P2) PCIE.26(NC13) PCIE.28(NC12) PCIE.29(PET_N1) PCIE.30(NC11) PCIE.31(PET_P1) PCIE.32(NC10) PCIE.34(NC9) PCIE.35(PER_N1) PCIE.36(NC8) PCIE.37(PER_P1) PCIE.38(DEVSLP) PCIE.40(NC7) PCIE.42(NC6) PCIE.44(NC5) PCIE.46(NC4) PCIE.48(NC3) PCIE.56(NC2) PCIE.58(NC1) PCIE.67(NC19) PCIE.69(PEDET)

### Notes on the sheet
- PCIE-M.2 M-KEY CONNECTOR | TEST CONNECTOR
- IO-GPIO JUMPERS
- SPI0 | SPI1
- PCIE POWER SUPPLY

## Sheet 5 of 8: ANALOG INPUT
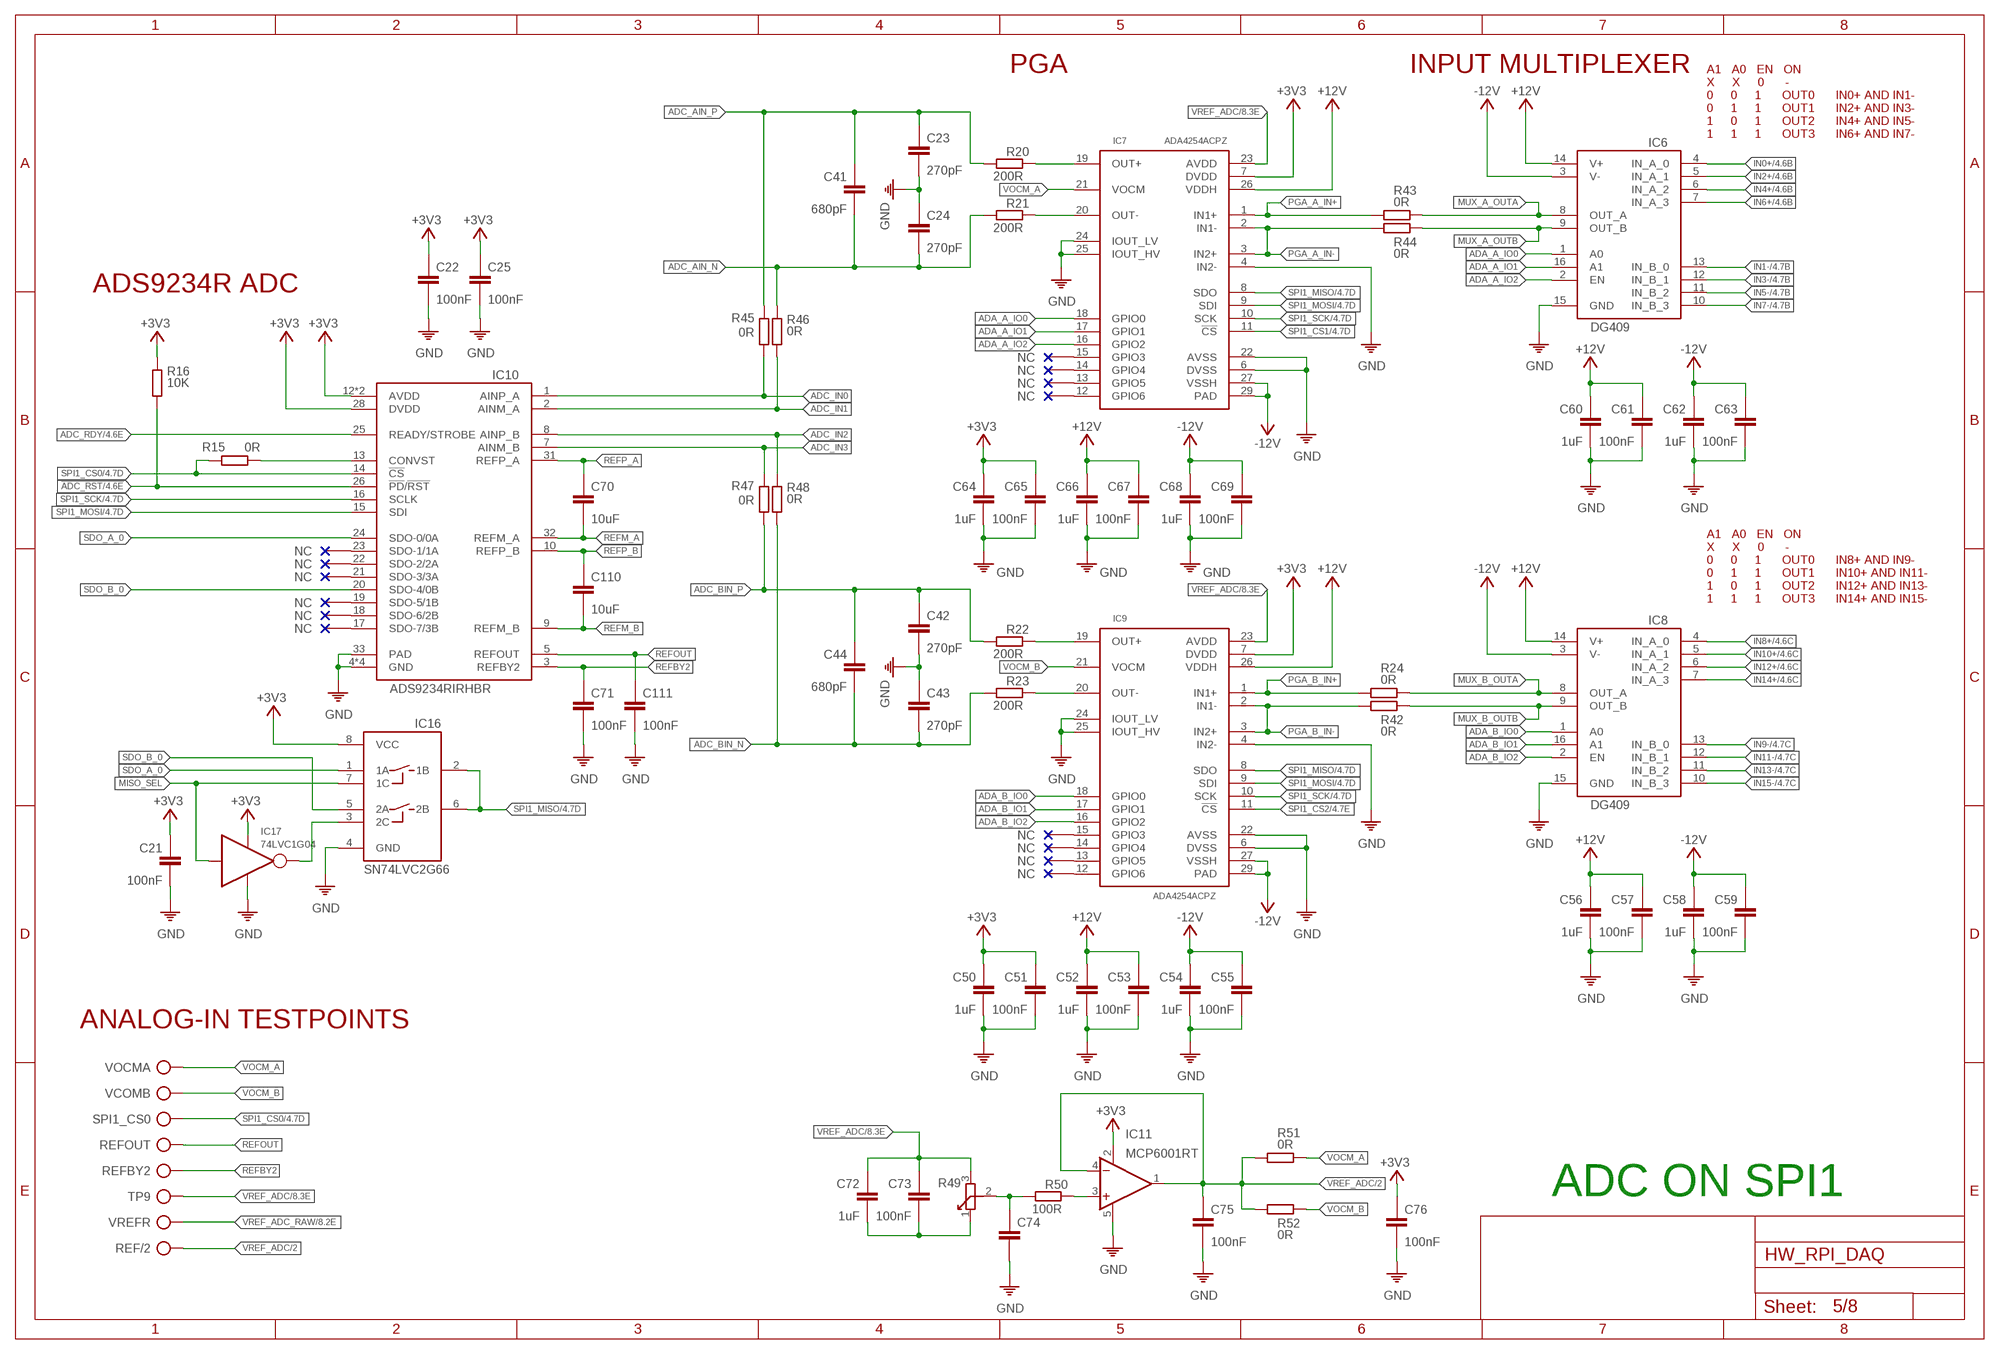
[diagram p4: schematic, sheet 5]

### Parts
C21  100nF  C0603  [0603]
C22  100nF  C0402  [0402]
C23  270pF  C0402  [0402]
C24  270pF  C0402  [0402]
C25  100nF  C0402  [0402]
C41  680pF  C0402  [0402]
C42  270pF  C0402  [0402]
C43  270pF  C0402  [0402]
C44  680pF  C0402  [0402]
C50  1uF  C0603  [0603]
C51  100nF  C0402  [0402]
C52  1uF  C0603  [0603]
C53  100nF  C0402  [0402]
C54  1uF  C0603  [0603]
C55  100nF  C0402  [0402]
C56  1uF  C0603  [0603]
C57  100nF  C0402  [0402]
C58  1uF  C0603  [0603]
C59  100nF  C0402  [0402]
C60  1uF  C0603  [0603]
C61  100nF  C0402  [0402]
C62  1uF  C0603  [0603]
C63  100nF  C0402  [0402]
C64  1uF  C0603  [0603]
C65  100nF  C0402  [0402]
C66  1uF  C0603  [0603]
C67  100nF  C0402  [0402]
C68  1uF  C0603  [0603]
C69  100nF  C0402  [0402]
C70  10uF  C0603  [0603]
C71  100nF  C0402  [0402]
C72  1uF  C0603  [0603]
C73  100nF  C0603  [0603]
C74  C0805  [0805]
C75  100nF  C0402  [0402]
C76  100nF  C0402  [0402]
C110  10uF  C0603  [0603]
C111  100nF  C0402  [0402]
IC6  DG409  DG409EUE+  [TSSOP2]
IC7  ADA4254ACPZ  [QFN50P500X500X75-29T314N]
IC8  DG409  DG409EUE+  [TSSOP2]
IC9  ADA4254ACPZ  [QFN50P500X500X75-29T314N]
IC10  ADS9234RIRHBR  [VQFN32-5X5]
IC11  MCP6001RT  [SOT23-5]
IC16  SN74LVC2G66  [SOP50P310X90-8N]
IC17  74LVC1G04  [SOT95P280X145-5N]
R15  0R  R0402  [0402]
R16  10K  R0402  [0402]
R20  200R  R0402  [0402]
R21  200R  R0402  [0402]
R22  200R  R0402  [0402]
R23  200R  R0402  [0402]
R24  0R  R0402  [0402]
R42  0R  R0402  [0402]
R43  0R  R0402  [0402]
R44  0R  R0402  [0402]
R45  0R  R0402  [0402]
R46  0R  R0402  [0402]
R47  0R  R0402  [0402]
R48  0R  R0402  [0402]
R49  R-TRIM  [TC33X]
R50  100R  R0402  [0402]
R51  0R  R0603  [0603]
R52  0R  R0603  [0603]
REF/2  TP  [TP]
REFBY2  TP  [TP]
REFOUT  TP  [TP]
SPI1_CS0  TP  [TP]
TP9  TP  [TP]
VCOMB  TP  [TP]
VOCMA  TP  [TP]
VREFR  TP  [TP]

### Nets
!ADC_RST: IC10.26(!PD!/!RST) R16.2 ; also sheet 4
!MISO_SEL: IC16.3(2C) IC17.4(OUT)
+3V3: C21.1 C22.1 C25.1 C50.1 C51.1 C64.1 C65.1 C76.1 IC7.7(DVDD) IC9.7(DVDD) IC10.12(AVDD) IC10.28(DVDD) IC10.29(AVDD) IC11.2(V+) IC16.8(VCC) IC17.5(V+) R16.1 ; also sheet 1,2,3,4,6,7,8
+12V: C52.1 C53.1 C56.1 C57.1 C60.1 C61.1 C66.1 C67.1 IC6.14(V+) IC7.26(VDDH) IC8.14(V+) IC9.26(VDDH) ; also sheet 8
-12V: C54.1 C55.1 C58.1 C59.1 C62.1 C63.1 C68.1 C69.1 IC6.3(V-) IC7.27(VSSH) IC7.29(PAD) IC8.3(V-) IC9.27(VSSH) IC9.29(PAD) ; also sheet 8
ADA_A_IO0: IC6.1(A0) IC7.18(GPIO0)
ADA_A_IO1: IC6.16(A1) IC7.17(GPIO1)
ADA_A_IO2: IC6.2(EN) IC7.16(GPIO2)
ADA_B_IO0: IC8.1(A0) IC9.18(GPIO0)
ADA_B_IO1: IC8.16(A1) IC9.17(GPIO1)
ADA_B_IO2: IC8.2(EN) IC9.16(GPIO2)
ADC_AIN_N [50R_DIFFPAIR]: C24.2 C41.2 R21.1 R46.1
ADC_AIN_P [50R_DIFFPAIR]: C23.1 C41.1 R20.1 R45.2
ADC_BIN_N [50R_DIFFPAIR]: C43.2 C44.2 R23.1 R48.2
ADC_BIN_P [50R_DIFFPAIR]: C42.1 C44.1 R22.1 R47.1
ADC_IN0: IC10.1(AINP_A) R45.1
ADC_IN1: IC10.2(AINM_A) R46.2
ADC_IN2: IC10.8(AINP_B) R48.1
ADC_IN3: IC10.7(AINM_B) R47.2
ADC_RDY: IC10.25(READY/STROBE) ; also sheet 4
GND: C21.2 C22.2 C23.2 C24.1 C25.2 C42.2 C43.1 C50.2 C51.2 C52.2 C53.2 C54.2 C55.2 C56.2 C57.2 C58.2 C59.2 C60.2 C61.2 C62.2 C63.2 C64.2 C65.2 C66.2 C67.2 C68.2 C69.2 C71.2 C74.2 C75.2 C76.2 C111.2 IC6.15(GND) IC7.4(IN2-) IC7.6(DVSS) IC7.22(AVSS) IC7.24(IOUT_LV) IC7.25(IOUT_HV) IC8.15(GND) IC9.4(IN2-) IC9.6(DVSS) IC9.22(AVSS) IC9.24(IOUT_LV) IC9.25(IOUT_HV) IC10.4(GND) IC10.11(GND) IC10.27(GND) IC10.30(GND) IC10.33(PAD) IC11.5(V-) IC16.4(GND) IC17.3(V-) ; also sheet 1,2,3,4,6,7,8
IN0+: IC6.4(IN_A_0) ; also sheet 4
IN1-: IC6.13(IN_B_0) ; also sheet 4
IN2+: IC6.5(IN_A_1) ; also sheet 4
IN3-: IC6.12(IN_B_1) ; also sheet 4
IN4+: IC6.6(IN_A_2) ; also sheet 4
IN5-: IC6.11(IN_B_2) ; also sheet 4
IN6+: IC6.7(IN_A_3) ; also sheet 4
IN7-: IC6.10(IN_B_3) ; also sheet 4
IN8+: IC8.4(IN_A_0) ; also sheet 4
IN9-: IC8.13(IN_B_0) ; also sheet 4
IN10+: IC8.5(IN_A_1) ; also sheet 4
IN11-: IC8.12(IN_B_1) ; also sheet 4
IN12+: IC8.6(IN_A_2) ; also sheet 4
IN13-: IC8.11(IN_B_2) ; also sheet 4
IN14+: IC8.7(IN_A_3) ; also sheet 4
IN15-: IC8.10(IN_B_3) ; also sheet 4
MISO_SEL: IC16.7(1C) IC17.2(IN)
MUX_A_OUTA: IC6.8(OUT_A) R43.2
MUX_A_OUTB: IC6.9(OUT_B) R44.1
MUX_B_OUTA: IC8.8(OUT_A) R24.2
MUX_B_OUTB: IC8.9(OUT_B) R42.1
N$12: IC7.19(OUT+) R20.2
N$13: IC7.20(OUT-) R21.2
N$15: IC9.19(OUT+) R22.2
N$16: IC9.20(OUT-) R23.2
N$18: IC10.13(CONVST) R15.2
N$19: C72.2 C73.2 R49.1
N$20: C74.1 R49.2 R50.1
N$21: IC11.3(+IN) R50.2
PGA_A_IN+: IC7.1(IN1+) R43.1
PGA_A_IN-: IC7.2(IN1-) IC7.3(IN2+) R44.2
PGA_B_IN+: IC9.1(IN1+) R24.1
PGA_B_IN-: IC9.2(IN1-) IC9.3(IN2+) R42.2
REFBY2: C71.1 IC10.3(REFBY2) REFBY2.TP
REFM_A: C70.2 IC10.32(REFM_A)
REFM_B: C110.2 IC10.9(REFM_B)
REFOUT: C111.1 IC10.5(REFOUT) REFOUT.TP
REFP_A: C70.1 IC10.31(REFP_A)
REFP_B: C110.1 IC10.10(REFP_B)
SDO_A_0: IC10.24(SDO-0/0A) IC16.1(1A)
SDO_B_0: IC10.20(SDO-4/0B) IC16.5(2A)
SPI1_CS0: IC10.14(!CS) R15.1 SPI1_CS0.TP ; also sheet 4
SPI1_CS1: IC7.11(!CS) ; also sheet 4
SPI1_CS2: IC9.11(!CS) ; also sheet 4
SPI1_MISO: IC7.8(SDO) IC9.8(SDO) IC16.2(1B) IC16.6(2B) ; also sheet 4
SPI1_MOSI: IC7.9(SDI) IC9.9(SDI) IC10.15(SDI) ; also sheet 4
SPI1_SCK: IC7.10(SCK) IC9.10(SCK) IC10.16(SCLK) ; also sheet 4
VOCM_A: IC7.21(VOCM) R51.2 VOCMA.TP
VOCM_B: IC9.21(VOCM) R52.1 VCOMB.TP
VREF_ADC: C72.1 C73.1 IC7.23(AVDD) IC9.23(AVDD) R49.3 TP9.TP ; also sheet 8
VREF_ADC/2: C75.1 IC11.1(OUT) IC11.4(-IN) R51.1 R52.2 REF/2.TP
VREF_ADC_RAW: VREFR.TP ; also sheet 8
Unconnected: IC7.12(GPIO6) IC7.13(GPIO5) IC7.14(GPIO4) IC7.15(GPIO3) IC9.12(GPIO6) IC9.13(GPIO5) IC9.14(GPIO4) IC9.15(GPIO3) IC10.17(SDO-7/3B) IC10.18(SDO-6/2B) IC10.19(SDO-5/1B) IC10.21(SDO-3/3A) IC10.22(SDO-2/2A) IC10.23(SDO-1/1A)

### Notes on the sheet
- PGA | INPUT MULTIPLEXER | A1   A0   EN   ON
- X     X     0      -
- 0     0     1      OUT0 | IN0+ AND IN1-
- 0     1     1      OUT1 | IN2+ AND IN3-
- 1     0     1      OUT2 | IN4+ AND IN5-
- 1     1     1      OUT3 | IN6+ AND IN7-
- ADS9234R ADC
- A1   A0   EN   ON
- X     X     0      -
- 0     0     1      OUT0 | IN8+ AND IN9-
- 0     1     1      OUT1 | IN10+ AND IN11-
- 1     0     1      OUT2 | IN12+ AND IN13-
- 1     1     1      OUT3 | IN14+ AND IN15-
- ANALOG-IN TESTPOINTS
- ADC ON SPI1

## Sheet 6 of 8: ANALOG OUTPUT
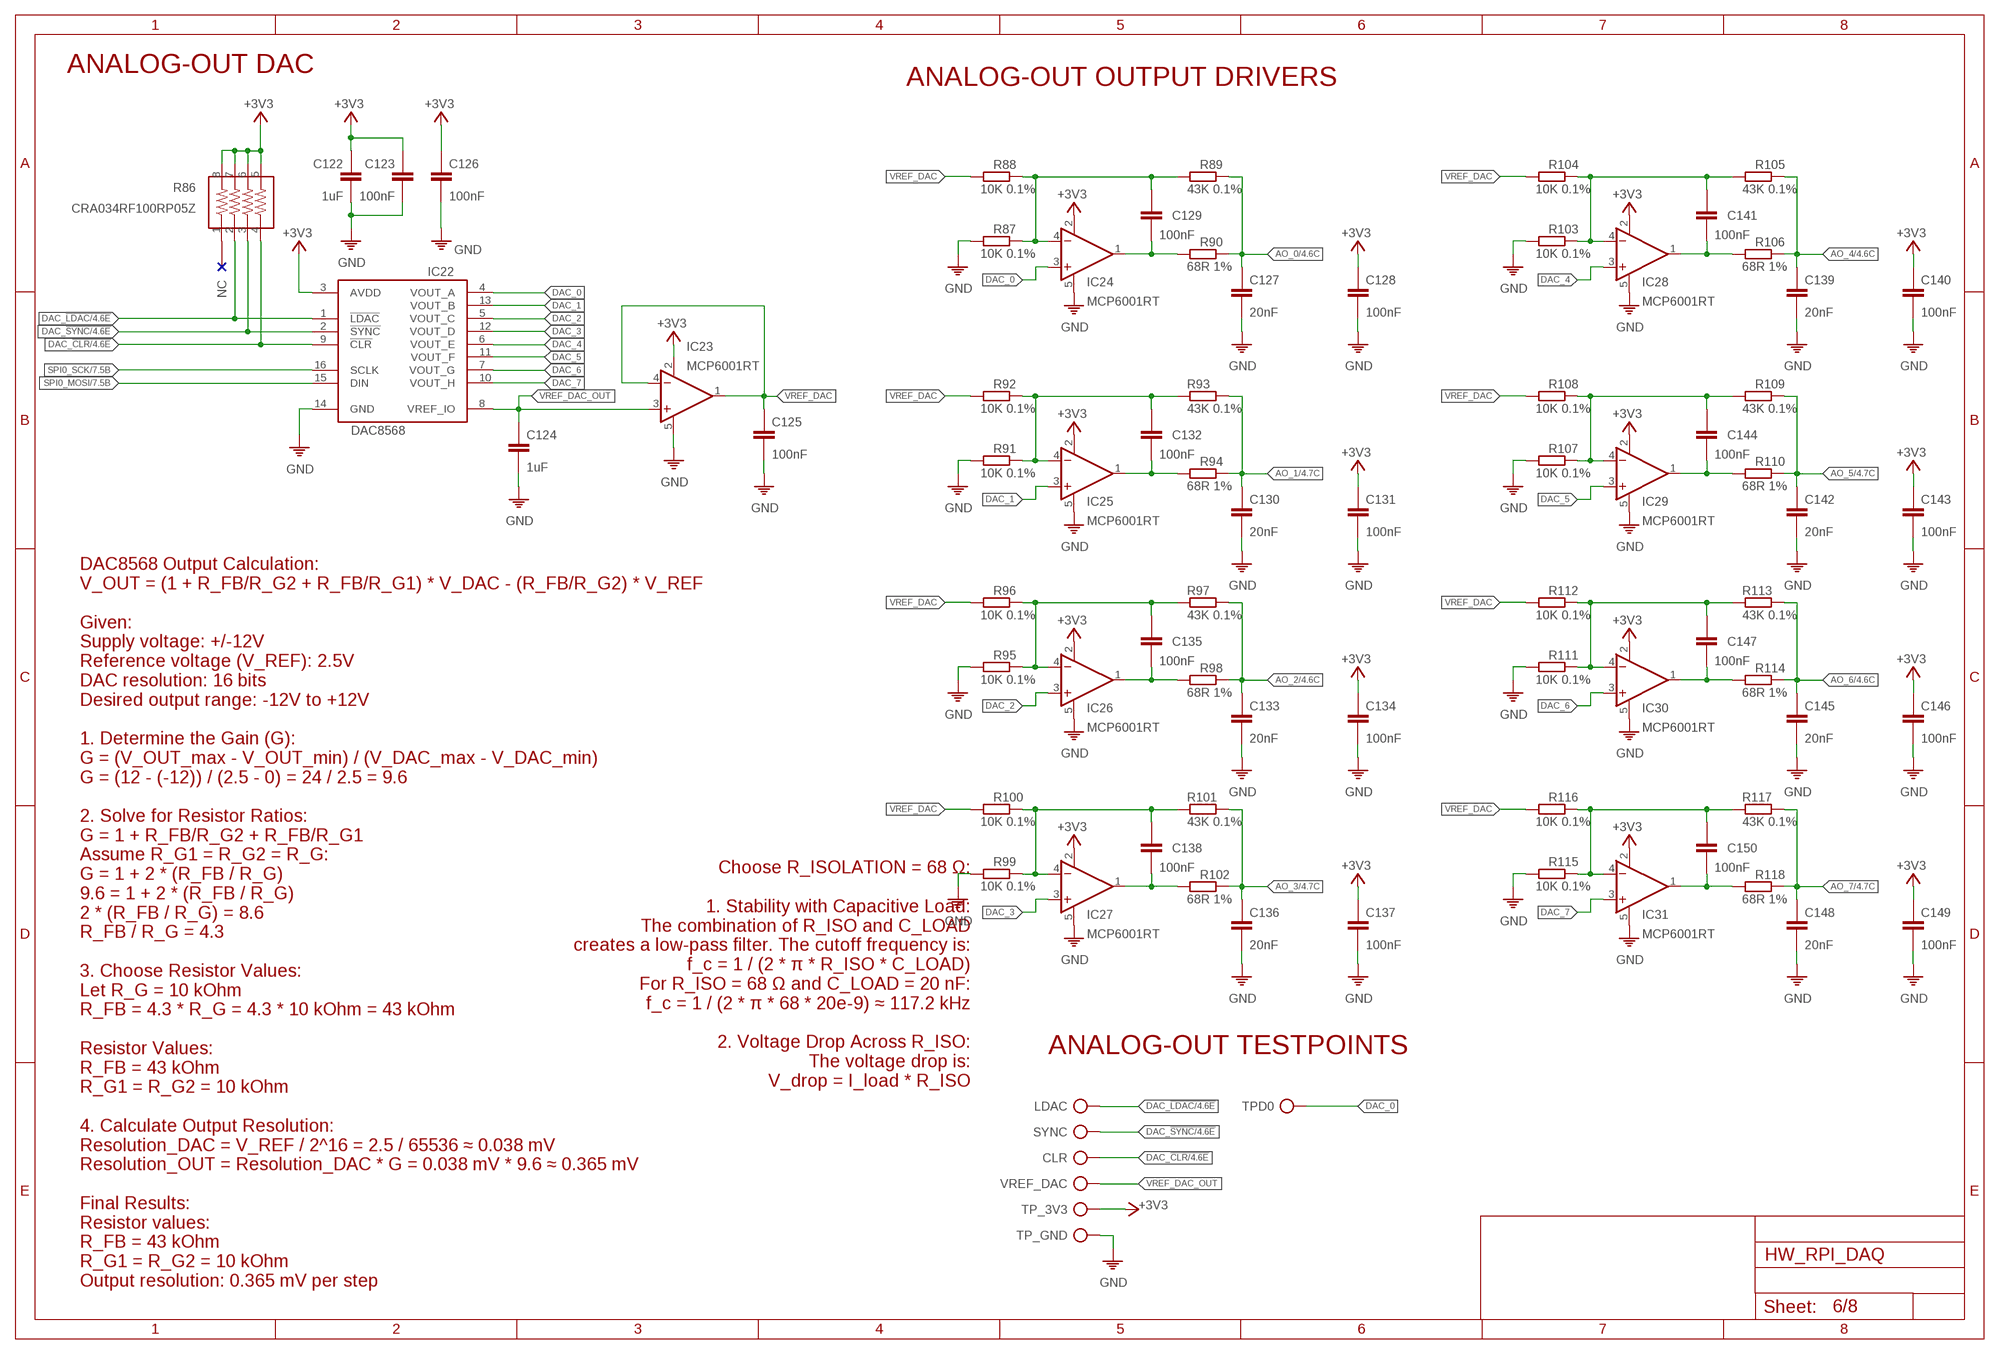
[diagram p5: schematic, sheet 6]

### Parts
C122  1uF  C0603  [0603]
C123  100nF  C0603  [0603]
C124  1uF  C0603  [0603]
C125  100nF  C0402  [0402]
C126  100nF  C0402  [0402]
C127  20nF  C0402  [0402]
C128  100nF  C0402  [0402]
C129  100nF  C0402  [0402]
C130  20nF  C0402  [0402]
C131  100nF  C0402  [0402]
C132  100nF  C0402  [0402]
C133  20nF  C0402  [0402]
C134  100nF  C0402  [0402]
C135  100nF  C0402  [0402]
C136  20nF  C0402  [0402]
C137  100nF  C0402  [0402]
C138  100nF  C0402  [0402]
C139  20nF  C0402  [0402]
C140  100nF  C0402  [0402]
C141  100nF  C0402  [0402]
C142  20nF  C0402  [0402]
C143  100nF  C0402  [0402]
C144  100nF  C0402  [0402]
C145  20nF  C0402  [0402]
C146  100nF  C0402  [0402]
C147  100nF  C0402  [0402]
C148  20nF  C0402  [0402]
C149  100nF  C0402  [0402]
C150  100nF  C0402  [0402]
CLR  TP  [TP]
IC22  DAC8568  [TSSOP16]
IC23  MCP6001RT  [SOT23-5]
IC24  MCP6001RT  [SOT23-5]
IC25  MCP6001RT  [SOT23-5]
IC26  MCP6001RT  [SOT23-5]
IC27  MCP6001RT  [SOT23-5]
IC28  MCP6001RT  [SOT23-5]
IC29  MCP6001RT  [SOT23-5]
IC30  MCP6001RT  [SOT23-5]
IC31  MCP6001RT  [SOT23-5]
LDAC  TP  [TP]
R86  CRA034RF100RP05Z  YC164-JR-0733RL  [YC164-JR-0733RL]
R87  10K 0.1%  R0402  [0402]
R88  10K 0.1%  R0402  [0402]
R89  43K 0.1%  R0402  [0402]
R90  68R 1%  R0402  [0402]
R91  10K 0.1%  R0402  [0402]
R92  10K 0.1%  R0402  [0402]
R93  43K 0.1%  R0402  [0402]
R94  68R 1%  R0402  [0402]
R95  10K 0.1%  R0402  [0402]
R96  10K 0.1%  R0402  [0402]
R97  43K 0.1%  R0402  [0402]
R98  68R 1%  R0402  [0402]
R99  10K 0.1%  R0402  [0402]
R100  10K 0.1%  R0402  [0402]
R101  43K 0.1%  R0402  [0402]
R102  68R 1%  R0402  [0402]
R103  10K 0.1%  R0402  [0402]
R104  10K 0.1%  R0402  [0402]
R105  43K 0.1%  R0402  [0402]
R106  68R 1%  R0402  [0402]
R107  10K 0.1%  R0402  [0402]
R108  10K 0.1%  R0402  [0402]
R109  43K 0.1%  R0402  [0402]
R110  68R 1%  R0402  [0402]
R111  10K 0.1%  R0402  [0402]
R112  10K 0.1%  R0402  [0402]
R113  43K 0.1%  R0402  [0402]
R114  68R 1%  R0402  [0402]
R115  10K 0.1%  R0402  [0402]
R116  10K 0.1%  R0402  [0402]
R117  43K 0.1%  R0402  [0402]
R118  68R 1%  R0402  [0402]
SYNC  TP  [TP]
TP_3V3  TP  [TP]
TP_GND  TP  [TP]
TPD0  TP  [TP]
VREF_DAC  TP  [TP]

### Nets
+3V3: C122.1 C123.1 C126.1 C128.1 C131.1 C134.1 C137.1 C140.1 C143.1 C146.1 C149.1 IC22.3(AVDD) IC23.2(V+) IC24.2(V+) IC25.2(V+) IC26.2(V+) IC27.2(V+) IC28.2(V+) IC29.2(V+) IC30.2(V+) IC31.2(V+) R86.5 R86.6 R86.7 R86.8 TP_3V3.TP ; also sheet 1,2,3,4,5,7,8
AO_0: C127.1 R89.2 R90.2 ; also sheet 4
AO_1: C130.1 R93.2 R94.2 ; also sheet 4
AO_2: C133.1 R97.2 R98.2 ; also sheet 4
AO_3: C136.1 R101.2 R102.2 ; also sheet 4
AO_4: C139.1 R105.2 R106.2 ; also sheet 4
AO_5: C142.1 R109.2 R110.2 ; also sheet 4
AO_6: C145.1 R113.2 R114.2 ; also sheet 4
AO_7: C148.1 R117.2 R118.2 ; also sheet 4
DAC_0: IC22.4(VOUT_A) IC24.3(+IN) TPD0.TP
DAC_1: IC22.13(VOUT_B) IC25.3(+IN)
DAC_2: IC22.5(VOUT_C) IC26.3(+IN)
DAC_3: IC22.12(VOUT_D) IC27.3(+IN)
DAC_4: IC22.6(VOUT_E) IC28.3(+IN)
DAC_5: IC22.11(VOUT_F) IC29.3(+IN)
DAC_6: IC22.7(VOUT_G) IC30.3(+IN)
DAC_7: IC22.10(VOUT_H) IC31.3(+IN)
DAC_!CLR: CLR.TP IC22.9(!CLR) R86.4 ; also sheet 4
DAC_!LDAC: IC22.1(!LDAC) LDAC.TP R86.2 ; also sheet 4
DAC_!SYNC: IC22.2(!SYNC) R86.3 SYNC.TP ; also sheet 4
GND: C122.2 C123.2 C124.2 C125.2 C126.2 C127.2 C128.2 C130.2 C131.2 C133.2 C134.2 C136.2 C137.2 C139.2 C140.2 C142.2 C143.2 C145.2 C146.2 C148.2 C149.2 IC22.14(GND) IC23.5(V-) IC24.5(V-) IC25.5(V-) IC26.5(V-) IC27.5(V-) IC28.5(V-) IC29.5(V-) IC30.5(V-) IC31.5(V-) R87.1 R91.1 R95.1 R99.1 R103.1 R107.1 R111.1 R115.1 TP_GND.TP ; also sheet 1,2,3,4,5,7,8
N$14: C129.2 IC24.1(OUT) R90.1
N$17: C129.1 IC24.4(-IN) R87.2 R88.2 R89.1
N$22: C132.1 IC25.4(-IN) R91.2 R92.2 R93.1
N$23: C132.2 IC25.1(OUT) R94.1
N$25: C135.1 IC26.4(-IN) R95.2 R96.2 R97.1
N$26: C135.2 IC26.1(OUT) R98.1
N$27: C138.1 IC27.4(-IN) R99.2 R100.2 R101.1
N$28: C138.2 IC27.1(OUT) R102.1
N$31: C141.1 IC28.4(-IN) R103.2 R104.2 R105.1
N$33: C141.2 IC28.1(OUT) R106.1
N$34: C144.1 IC29.4(-IN) R107.2 R108.2 R109.1
N$40: C144.2 IC29.1(OUT) R110.1
N$41: C147.1 IC30.4(-IN) R111.2 R112.2 R113.1
N$58: C147.2 IC30.1(OUT) R114.1
N$59: C150.1 IC31.4(-IN) R115.2 R116.2 R117.1
N$60: C150.2 IC31.1(OUT) R118.1
SPI0_MOSI: IC22.15(DIN) ; also sheet 4,7
SPI0_SCK: IC22.16(SCLK) ; also sheet 4,7
VREF_DAC: C125.1 IC23.1(OUT) IC23.4(-IN) R88.1 R92.1 R96.1 R100.1 R104.1 R108.1 R112.1 R116.1
VREF_DAC_OUT: C124.1 IC22.8(VREF_IO) IC23.3(+IN) VREF_DAC.TP
Unconnected: R86.1

### Notes on the sheet
- ANALOG-OUT DAC
- ANALOG-OUT OUTPUT DRIVERS
- Choose R_ISOLATION = 68 Ω:
  
  1. Stability with Capacitive Load:
  The combination of R_ISO and C_LOAD
  creates a low-pass filter. The cutoff frequency is:
  f_c = 1 / (2 * π * R_ISO * C_LOAD)
  For R_ISO = 68 Ω and C_LOAD = 20 nF:
  f_c = 1 / (2 * π * 68 * 20e-9) ≈ 117.2 kHz
  
  2. Voltage Drop Across R_ISO:
  The voltage drop is:
  V_drop = I_load * R_ISO
- ANALOG-OUT TESTPOINTS
- DAC8568 Output Calculation:
  V_OUT = (1 + R_FB/R_G2 + R_FB/R_G1) * V_DAC - (R_FB/R_G2) * V_REF
  
  Given:
  Supply voltage: +/-12V
  Reference voltage (V_REF): 2.5V
  DAC resolution: 16 bits
  Desired output range: -12V to +12V
  
  1. Determine the Gain (G):
  G = (V_OUT_max - V_OUT_min) / (V_DAC_max - V_DAC_min)
  G = (12 - (-12)) / (2.5 - 0) = 24 / 2.5 = 9.6
  
  2. Solve for Resistor Ratios:
  G = 1 + R_FB/R_G2 + R_FB/R_G1
  Assume R_G1 = R_G2 = R_G:
  G = 1 + 2 * (R_FB / R_G)
  9.6 = 1 + 2 * (R_FB / R_G)
  2 * (R_FB / R_G) = 8.6
  R_FB / R_G = 4.3
  
  3. Choose Resistor Values:
  Let R_G = 10 kOhm
  R_FB = 4.3 * R_G = 4.3 * 10 kOhm = 43 kOhm
  
  Resistor Values:
  R_FB = 43 kOhm
  R_G1 = R_G2 = 10 kOhm
  
  4. Calculate Output Resolution:
  Resolution_DAC = V_REF / 2^16 = 2.5 / 65536 ≈ 0.038 mV
  Resolution_OUT = Resolution_DAC * G = 0.038 mV * 9.6 ≈ 0.365 mV
  
  Final Results:
  Resistor values:
  R_FB = 43 kOhm
  R_G1 = R_G2 = 10 kOhm
  Output resolution: 0.365 mV per step

## Sheet 7 of 8: DIGITAL IO
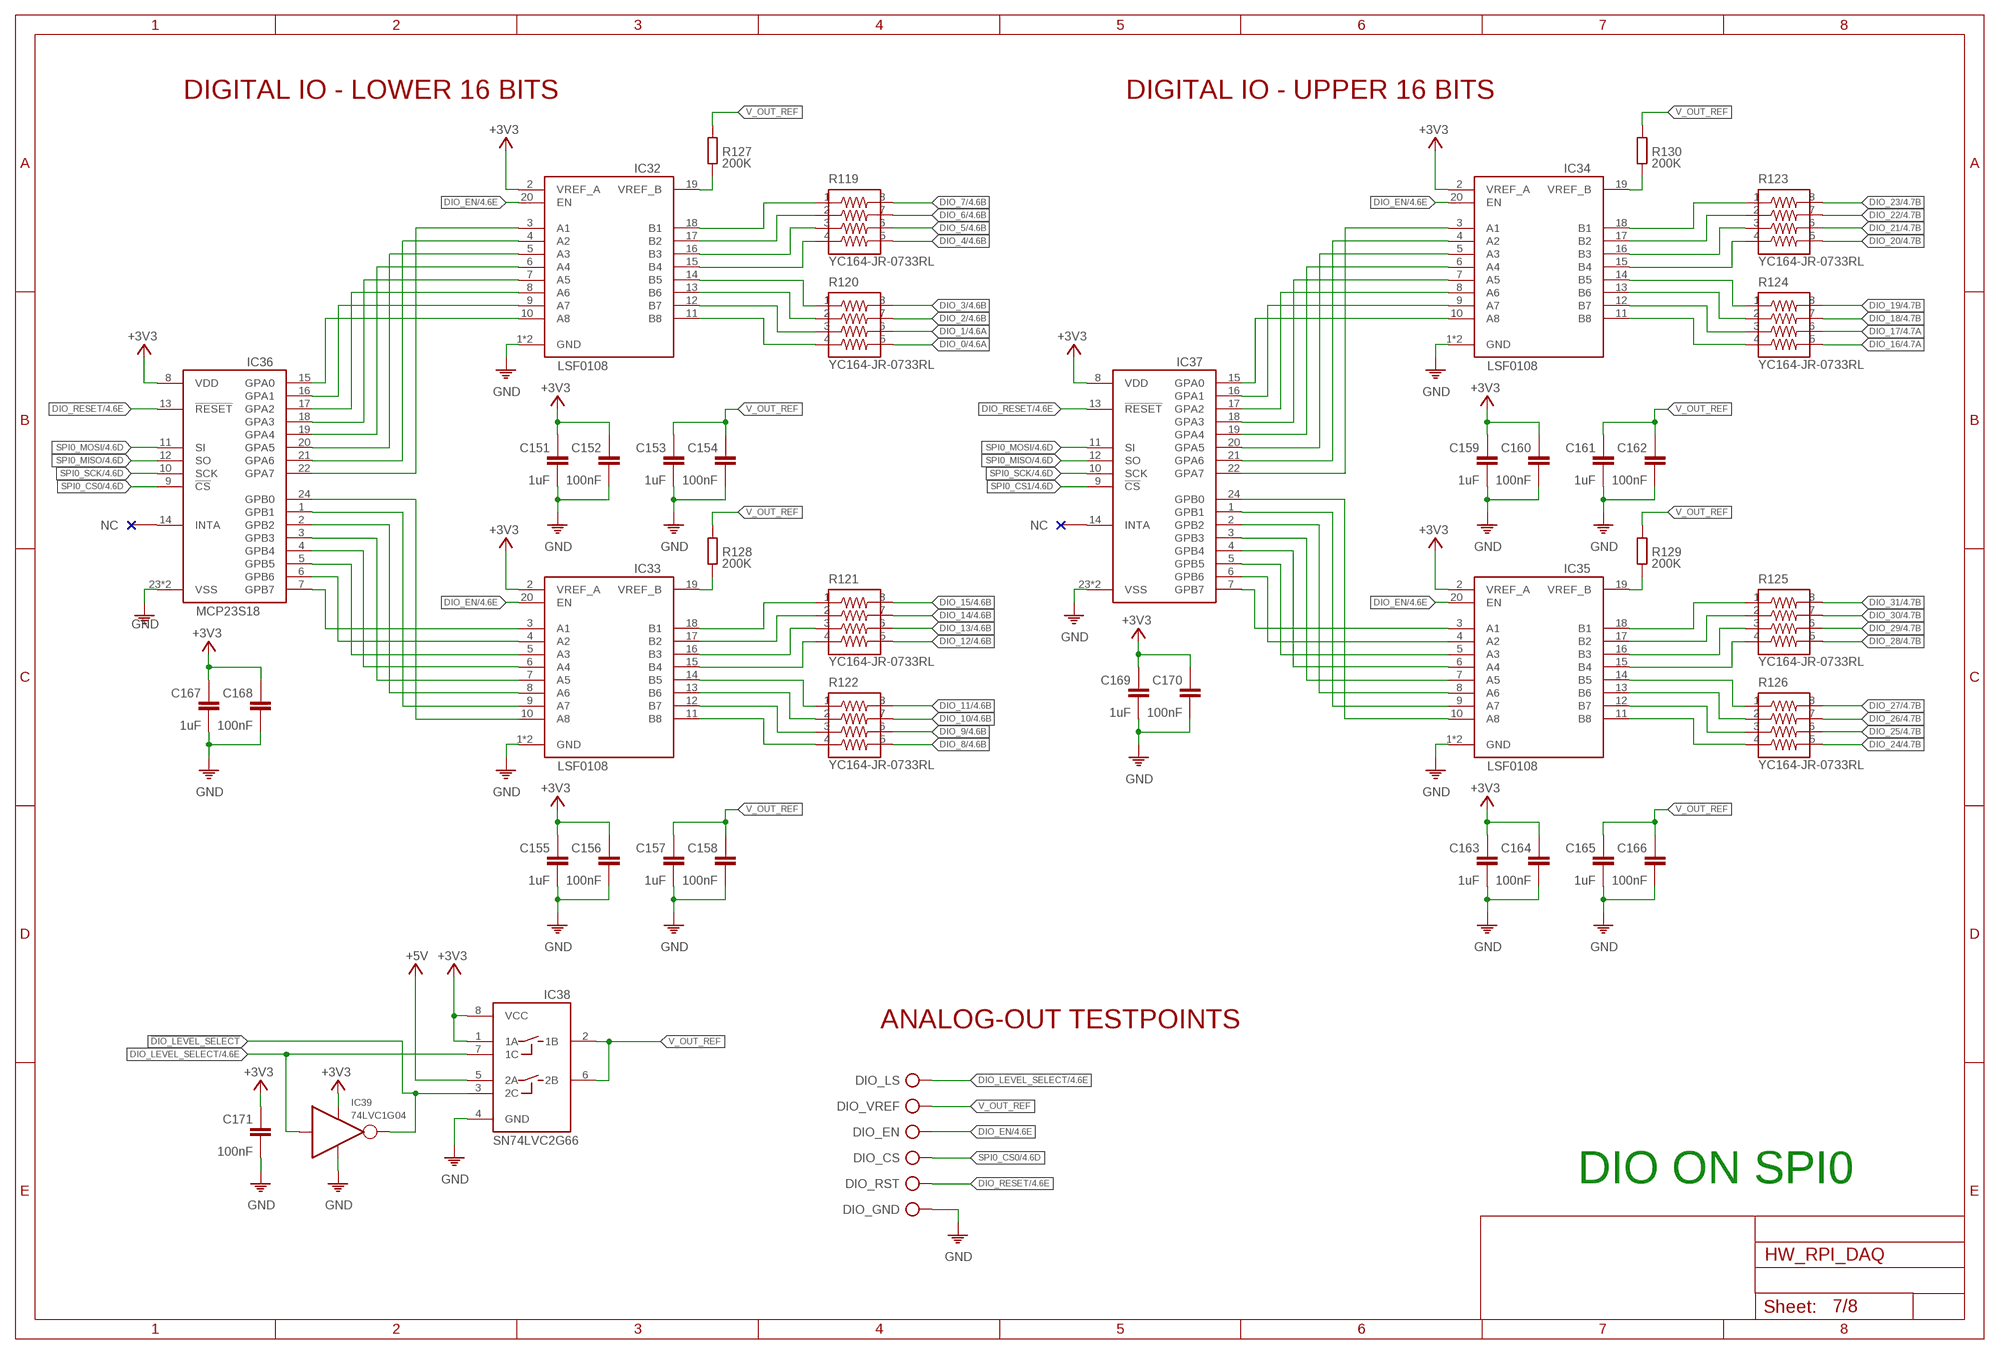
[diagram p6: schematic, sheet 7]

### Parts
C151  1uF  C0402  [0402]
C152  100nF  C0402  [0402]
C153  1uF  C0402  [0402]
C154  100nF  C0402  [0402]
C155  1uF  C0402  [0402]
C156  100nF  C0402  [0402]
C157  1uF  C0402  [0402]
C158  100nF  C0402  [0402]
C159  1uF  C0402  [0402]
C160  100nF  C0402  [0402]
C161  1uF  C0402  [0402]
C162  100nF  C0402  [0402]
C163  1uF  C0402  [0402]
C164  100nF  C0402  [0402]
C165  1uF  C0402  [0402]
C166  100nF  C0402  [0402]
C167  1uF  C0402  [0402]
C168  100nF  C0402  [0402]
C169  1uF  C0402  [0402]
C170  100nF  C0402  [0402]
C171  100nF  C0603  [0603]
DIO_CS  TP  [TP]
DIO_EN  TP  [TP]
DIO_GND  TP  [TP]
DIO_LS  TP  [TP]
DIO_RST  TP  [TP]
DIO_VREF  TP  [TP]
IC32  LSF0108  LSF0108-Q1  [VQFN20]
IC33  LSF0108  LSF0108-Q1  [VQFN20]
IC34  LSF0108  LSF0108-Q1  [VQFN20]
IC35  LSF0108  LSF0108-Q1  [VQFN20]
IC36  MCP23S18  [QFN50P400X400X100-25T265]
IC37  MCP23S18  [QFN50P400X400X100-25T265]
IC38  SN74LVC2G66  [SOP50P310X90-8N]
IC39  74LVC1G04  [SOT95P280X145-5N]
R119  YC164-JR-0733RL  [YC164-JR-0733RL]
R120  YC164-JR-0733RL  [YC164-JR-0733RL]
R121  YC164-JR-0733RL  [YC164-JR-0733RL]
R122  YC164-JR-0733RL  [YC164-JR-0733RL]
R123  YC164-JR-0733RL  [YC164-JR-0733RL]
R124  YC164-JR-0733RL  [YC164-JR-0733RL]
R125  YC164-JR-0733RL  [YC164-JR-0733RL]
R126  YC164-JR-0733RL  [YC164-JR-0733RL]
R127  200K  R0402  [0402]
R128  200K  R0402  [0402]
R129  200K  R0402  [0402]
R130  200K  R0402  [0402]

### Nets
!DIO_LEVEL_SELECT: IC38.3(2C) IC39.4(OUT)
+3V3: C151.1 C152.1 C155.1 C156.1 C159.1 C160.1 C163.1 C164.1 C167.1 C168.1 C169.1 C170.1 C171.1 IC32.2(VREF_A) IC33.2(VREF_A) IC34.2(VREF_A) IC35.2(VREF_A) IC36.8(VDD) IC37.8(VDD) IC38.1(1A) IC38.8(VCC) IC39.5(V+) ; also sheet 1,2,3,4,5,6,8
+5V: IC38.5(2A) ; also sheet 1,2,3,4,8
DIO_0: R120.5 ; also sheet 4
DIO_1: R120.6 ; also sheet 4
DIO_2: R120.7 ; also sheet 4
DIO_3: R120.8 ; also sheet 4
DIO_4: R119.5 ; also sheet 4
DIO_5: R119.6 ; also sheet 4
DIO_6: R119.7 ; also sheet 4
DIO_7: R119.8 ; also sheet 4
DIO_8: R122.5 ; also sheet 4
DIO_9: R122.6 ; also sheet 4
DIO_10: R122.7 ; also sheet 4
DIO_11: R122.8 ; also sheet 4
DIO_12: R121.5 ; also sheet 4
DIO_13: R121.6 ; also sheet 4
DIO_14: R121.7 ; also sheet 4
DIO_15: R121.8 ; also sheet 4
DIO_16: R124.5 ; also sheet 4
DIO_17: R124.6 ; also sheet 4
DIO_18: R124.7 ; also sheet 4
DIO_19: R124.8 ; also sheet 4
DIO_20: R123.5 ; also sheet 4
DIO_21: R123.6 ; also sheet 4
DIO_22: R123.7 ; also sheet 4
DIO_23: R123.8 ; also sheet 4
DIO_24: R126.5 ; also sheet 4
DIO_25: R126.6 ; also sheet 4
DIO_26: R126.7 ; also sheet 4
DIO_27: R126.8 ; also sheet 4
DIO_28: R125.5 ; also sheet 4
DIO_29: R125.6 ; also sheet 4
DIO_30: R125.7 ; also sheet 4
DIO_31: R125.8 ; also sheet 4
DIO_EN: DIO_EN.TP IC32.20(EN) IC33.20(EN) IC34.20(EN) IC35.20(EN) ; also sheet 4
DIO_LEVEL_SELECT: DIO_LS.TP IC38.7(1C) IC39.2(IN) ; also sheet 4
DIO_RESET: DIO_RST.TP IC36.13(!RESET) IC37.13(!RESET) ; also sheet 4
GND: C151.2 C152.2 C153.2 C154.2 C155.2 C156.2 C157.2 C158.2 C159.2 C160.2 C161.2 C162.2 C163.2 C164.2 C165.2 C166.2 C167.2 C168.2 C169.2 C170.2 C171.2 DIO_GND.TP IC32.1(GND) IC32.PAD(GND) IC33.1(GND) IC33.PAD(GND) IC34.1(GND) IC34.PAD(GND) IC35.1(GND) IC35.PAD(GND) IC36.23(VSS) IC36.25(VSS) IC37.23(VSS) IC37.25(VSS) IC38.4(GND) IC39.3(V-) ; also sheet 1,2,3,4,5,6,8
N$29: IC33.9(A7) IC36.1(GPB1)
N$61: IC32.10(A8) IC36.15(GPA0)
N$62: IC32.9(A7) IC36.16(GPA1)
N$63: IC32.8(A6) IC36.17(GPA2)
N$64: IC32.7(A5) IC36.18(GPA3)
N$65: IC32.6(A4) IC36.19(GPA4)
N$66: IC32.5(A3) IC36.20(GPA5)
N$67: IC32.4(A2) IC36.21(GPA6)
N$68: IC32.3(A1) IC36.22(GPA7)
N$69: IC32.18(B1) R119.1
N$70: IC32.17(B2) R119.2
N$71: IC32.16(B3) R119.3
N$72: IC32.15(B4) R119.4
N$73: IC32.14(B5) R120.1
N$74: IC32.13(B6) R120.2
N$75: IC32.12(B7) R120.3
N$76: IC32.11(B8) R120.4
N$77: IC33.10(A8) IC36.24(GPB0)
N$78: IC33.8(A6) IC36.2(GPB2)
N$79: IC33.7(A5) IC36.3(GPB3)
N$80: IC33.6(A4) IC36.4(GPB4)
N$81: IC33.5(A3) IC36.5(GPB5)
N$82: IC33.4(A2) IC36.6(GPB6)
N$83: IC33.3(A1) IC36.7(GPB7)
N$84: IC33.18(B1) R121.1
N$85: IC33.17(B2) R121.2
N$86: IC33.16(B3) R121.3
N$87: IC33.15(B4) R121.4
N$88: IC33.14(B5) R122.1
N$89: IC33.13(B6) R122.2
N$90: IC33.12(B7) R122.3
N$91: IC33.11(B8) R122.4
N$92: IC34.10(A8) IC37.15(GPA0)
N$93: IC34.9(A7) IC37.16(GPA1)
N$94: IC34.8(A6) IC37.17(GPA2)
N$95: IC34.7(A5) IC37.18(GPA3)
N$96: IC34.6(A4) IC37.19(GPA4)
N$97: IC34.5(A3) IC37.20(GPA5)
N$98: IC34.4(A2) IC37.21(GPA6)
N$99: IC34.3(A1) IC37.22(GPA7)
N$100: IC34.18(B1) R123.1
N$101: IC34.17(B2) R123.2
N$102: IC34.16(B3) R123.3
N$103: IC34.15(B4) R123.4
N$104: IC34.14(B5) R124.1
N$105: IC34.13(B6) R124.2
N$106: IC34.12(B7) R124.3
N$107: IC34.11(B8) R124.4
N$108: IC35.8(A6) IC37.2(GPB2)
N$109: IC35.7(A5) IC37.3(GPB3)
N$110: IC35.6(A4) IC37.4(GPB4)
N$111: IC35.5(A3) IC37.5(GPB5)
N$112: IC35.4(A2) IC37.6(GPB6)
N$113: IC35.3(A1) IC37.7(GPB7)
N$114: IC35.9(A7) IC37.1(GPB1)
N$115: IC35.10(A8) IC37.24(GPB0)
N$116: IC35.18(B1) R125.1
N$117: IC35.17(B2) R125.2
N$118: IC35.16(B3) R125.3
N$119: IC35.15(B4) R125.4
N$120: IC35.14(B5) R126.1
N$121: IC35.13(B6) R126.2
N$122: IC35.12(B7) R126.3
N$123: IC35.11(B8) R126.4
N$124: IC32.19(VREF_B) R127.1
N$125: IC33.19(VREF_B) R128.1
N$126: IC35.19(VREF_B) R129.1
N$127: IC34.19(VREF_B) R130.1
SPI0_CS0: DIO_CS.TP IC36.9(!CS) ; also sheet 4
SPI0_CS1: IC37.9(!CS) ; also sheet 4
SPI0_MISO: IC36.12(SO) IC37.12(SO) ; also sheet 4
SPI0_MOSI: IC36.11(SI) IC37.11(SI) ; also sheet 4,6
SPI0_SCK: IC36.10(SCK) IC37.10(SCK) ; also sheet 4,6
V_OUT_REF: C153.1 C154.1 C157.1 C158.1 C161.1 C162.1 C165.1 C166.1 DIO_VREF.TP IC38.2(1B) IC38.6(2B) R127.2 R128.2 R129.2 R130.2
Unconnected: IC36.14(INTA) IC37.14(INTA)

### Notes on the sheet
- DIGITAL IO - LOWER 16 BITS | DIGITAL IO - UPPER 16 BITS
- ANALOG-OUT TESTPOINTS
- DIO ON SPI0

## Sheet 8 of 8: POWER
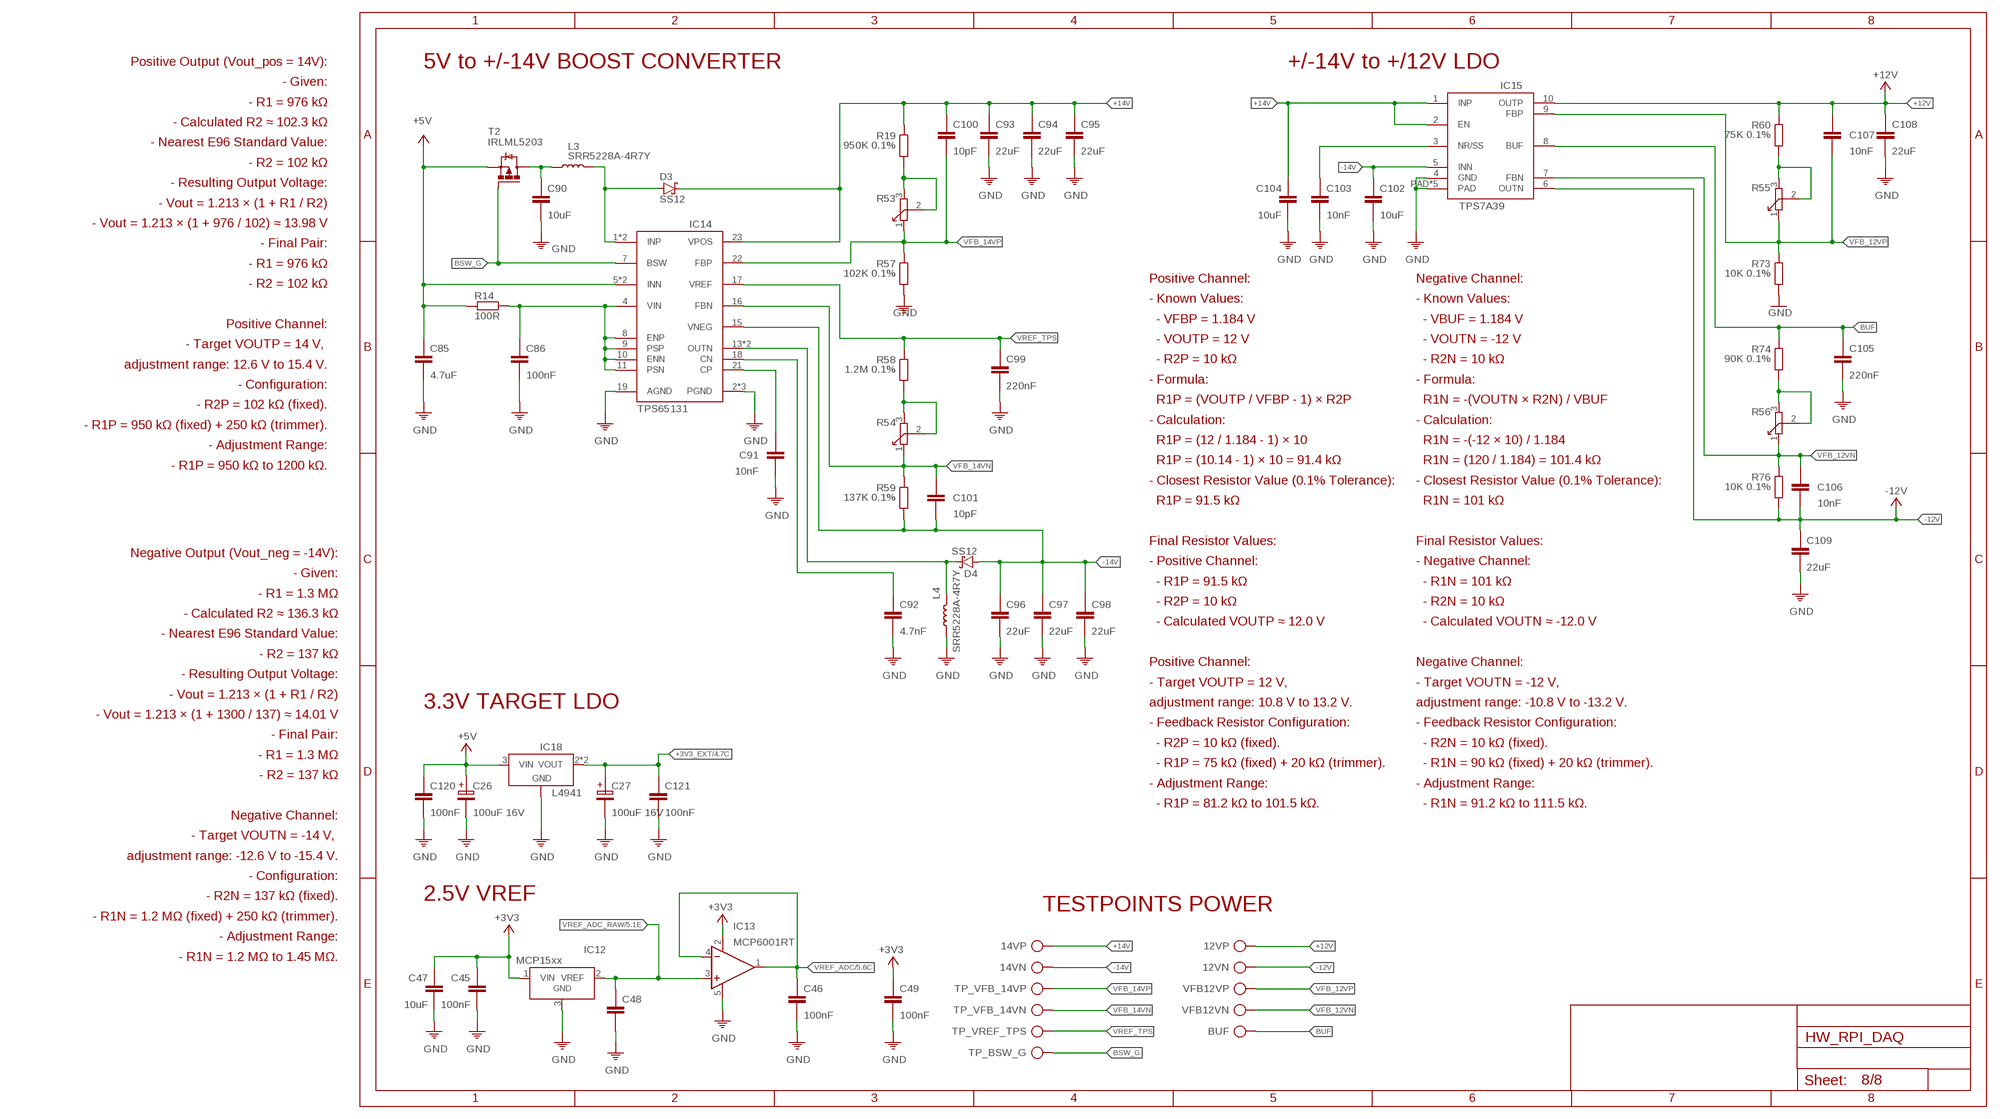
[diagram p7: schematic, sheet 8]

### Parts
12VN  TP  [TP]
12VP  TP  [TP]
14VN  TP  [TP]
14VP  TP  [TP]
BUF  TP  [TP]
C26  100uF 16V  CPOL  [100UF-16V]
C27  100uF 16V  CPOL  [100UF-16V]
C45  100nF  C0402  [0402]
C46  100nF  C0402  [0402]
C47  10uF  C0805  [0805]
C48  C0805  [0805]
C49  100nF  C0402  [0402]
C85  4.7uF  C0805  [0805]
C86  100nF  C0805  [0805]
C90  10uF  C0805  [0805]
C91  10nF  C0805  [0805]
C92  4.7nF  C0805  [0805]
C93  22uF  C1206  [1206]
C94  22uF  C1206  [1206]
C95  22uF  C1206  [1206]
C96  22uF  C1206  [1206]
C97  22uF  C1206  [1206]
C98  22uF  C1206  [1206]
C99  220nF  C0402  [0402]
C100  10pF  C0402  [0402]
C101  10pF  C0402  [0402]
C102  10uF  C1206  [1206]
C103  10nF  C0402  [0402]
C104  10uF  C1206  [1206]
C105  220nF  C0402  [0402]
C106  10nF  C0402  [0402]
C107  10nF  C0402  [0402]
C108  22uF  C1206  [1206]
C109  22uF  C1206  [1206]
C120  100nF  C0402  [0402]
C121  100nF  C0402  [0402]
D3  SS12  [SMA]
D4  SS12  [SMA]
IC12  MCP1525T-I/TT  [SOT23]
IC13  MCP6001RT  [SOT23-5]
IC14  TPS65131  TPS65131TRGERQ1  [VQFN24-4X4-THERMAL2.5X2.5]
IC15  TPS7A39  TPS7A3901DSCR  [WSON10-3X3]
IC18  LDL1117S33R  [SOT230]
L3  SRR5228A-4R7Y  L  [SRR5228A]
L4  SRR5228A-4R7Y  L  [SRR5228A]
R14  100R  R1206  [1206]
R19  950K 0.1%  R0402  [0402]
R53  R-TRIM  [TC33X]
R54  R-TRIM  [TC33X]
R55  R-TRIM  [TC33X]
R56  R-TRIM  [TC33X]
R57  102K 0.1%  R0402  [0402]
R58  1.2M 0.1%  R0402  [0402]
R59  137K 0.1%  R0402  [0402]
R60  75K 0.1%  R0402  [0402]
R73  10K 0.1%  R0402  [0402]
R74  90K 0.1%  R0402  [0402]
R76  10K 0.1%  R0402  [0402]
T2  IRLML5203  [MICRO3]
TP_BSW_G  TP  [TP]
TP_VFB_14VN  TP  [TP]
TP_VFB_14VP  TP  [TP]
TP_VREF_TPS  TP  [TP]
VFB12VN  TP  [TP]
VFB12VP  TP  [TP]

### Nets
+3V3: C45.1 C47.1 C49.1 IC12.1(VIN) IC13.2(V+) ; also sheet 1,2,3,4,5,6,7
+3V3_EXT: C27.1 C121.1 IC18.2(VOUT) IC18.4(VOUT) ; also sheet 4
+5V: C26.1 C85.1 C120.1 IC14.5(INN) IC14.6(INN) IC18.3(VIN) R14.2 T2.2(S) ; also sheet 1,2,3,4,7
+12V: 12VP.TP C107.2 C108.1 IC15.10(OUTP) R60.1 ; also sheet 5
+14V: 14VP.TP C93.1 C94.1 C95.1 C100.1 C104.1 D3.C IC14.23(VPOS) IC15.1(INP) IC15.2(EN) R19.1
-12V: 12VN.TP C106.1 C109.1 IC15.6(OUTN) R76.2 ; also sheet 5
-14V: 14VN.TP C96.1 C97.1 C98.1 C101.1 C102.1 D4.A IC14.15(VNEG) IC15.5(INN) R59.2
BSW_G: IC14.7(BSW) T2.1(G) TP_BSW_G.TP
BUF: BUF.TP C105.2 IC15.8(BUF) R74.1
GND: C26.2 C27.2 C45.2 C46.2 C47.2 C48.2 C49.2 C85.2 C86.2 C90.2 C91.2 C92.2 C93.2 C94.2 C95.2 C96.2 C97.2 C98.2 C99.1 C102.2 C103.2 C104.2 C105.1 C108.2 C109.2 C120.2 C121.2 IC12.3(GND) IC13.5(V-) IC14.2(PGND) IC14.3(PGND) IC14.19(AGND) IC14.25(PGND) IC15.4(GND) IC15.PAD IC15.PAD1(PAD) IC15.PAD2(PAD) IC15.PAD3(PAD) IC15.PAD4(PAD) IC18.1(GND) L4.1 R57.2 R73.2 ; also sheet 1,2,3,4,5,6,7
N$24: D3.A IC14.1(INP) IC14.24(INP) L3.2
N$30: C90.1 L3.1 T2.3(D)
N$32: C86.1 IC14.4(VIN) IC14.8(ENP) IC14.9(PSP) IC14.10(ENN) IC14.11(PSN) R14.1
N$35: C91.1 IC14.21(CP)
N$36: C92.1 IC14.18(CN)
N$37: D4.C IC14.13(OUTN) IC14.14(OUTN) L4.2
N$38: R55.2 R55.3 R60.2
N$39: C103.1 IC15.3(NR/SS)
N$42: R56.2 R56.3 R74.2
N$43: R19.2 R53.2 R53.3
N$44: R54.2 R54.3 R58.2
VFB_12VN: C106.2 IC15.7(FBN) R56.1 R76.1 VFB12VN.TP
VFB_12VP: C107.1 IC15.9(FBP) R55.1 R73.1 VFB12VP.TP
VFB_14VN: C101.2 IC14.16(FBN) R54.1 R59.1 TP_VFB_14VN.TP
VFB_14VP: C100.2 IC14.22(FBP) R53.1 R57.1 TP_VFB_14VP.TP
VREF_ADC: C46.1 IC13.1(OUT) IC13.4(-IN) ; also sheet 5
VREF_ADC_RAW: C48.1 IC12.2(VREF) IC13.3(+IN) ; also sheet 5
VREF_TPS: C99.2 IC14.17(VREF) R58.1 TP_VREF_TPS.TP

### Notes on the sheet
- 5V to +/-14V BOOST CONVERTER | +/-14V to +/12V LDO
- Positive Output (Vout_pos = 14V):
  - Given:
    - R1 = 976 kΩ
    - Calculated R2 ≈ 102.3 kΩ
  - Nearest E96 Standard Value:
    - R2 = 102 kΩ
  - Resulting Output Voltage:
    - Vout = 1.213 × (1 + R1 / R2)
    - Vout = 1.213 × (1 + 976 / 102) ≈ 13.98 V
  - Final Pair:
    - R1 = 976 kΩ
    - R2 = 102 kΩ
  
  Positive Channel:
  - Target VOUTP = 14 V, 
  adjustment range: 12.6 V to 15.4 V.
  - Configuration:
    - R2P = 102 kΩ (fixed).
    - R1P = 950 kΩ (fixed) + 250 kΩ (trimmer).
  - Adjustment Range:
    - R1P = 950 kΩ to 1200 kΩ.
- Positive Channel:
  - Known Values:
    - VFBP = 1.184 V
    - VOUTP = 12 V
    - R2P = 10 kΩ
  - Formula:
    R1P = (VOUTP / VFBP - 1) × R2P
  - Calculation:
    R1P = (12 / 1.184 - 1) × 10
    R1P = (10.14 - 1) × 10 = 91.4 kΩ
  - Closest Resistor Value (0.1% Tolerance):
    R1P = 91.5 kΩ
  
  Final Resistor Values:
  - Positive Channel:
    - R1P = 91.5 kΩ
    - R2P = 10 kΩ
    - Calculated VOUTP ≈ 12.0 V
  
  Positive Channel:
  - Target VOUTP = 12 V, 
  adjustment range: 10.8 V to 13.2 V.
  - Feedback Resistor Configuration:
    - R2P = 10 kΩ (fixed).
    - R1P = 75 kΩ (fixed) + 20 kΩ (trimmer).
  - Adjustment Range:
    - R1P = 81.2 kΩ to 101.5 kΩ.
- Negative Channel:
  - Known Values:
    - VBUF = 1.184 V
    - VOUTN = -12 V
    - R2N = 10 kΩ
  - Formula:
    R1N = -(VOUTN × R2N) / VBUF
  - Calculation:
    R1N = -(-12 × 10) / 1.184
    R1N = (120 / 1.184) = 101.4 kΩ
  - Closest Resistor Value (0.1% Tolerance):
    R1N = 101 kΩ
  
  Final Resistor Values:
  - Negative Channel:
    - R1N = 101 kΩ
    - R2N = 10 kΩ
    - Calculated VOUTN ≈ -12.0 V
  
  Negative Channel:
  - Target VOUTN = -12 V, 
  adjustment range: -10.8 V to -13.2 V.
  - Feedback Resistor Configuration:
    - R2N = 10 kΩ (fixed).
    - R1N = 90 kΩ (fixed) + 20 kΩ (trimmer).
  - Adjustment Range:
    - R1N = 91.2 kΩ to 111.5 kΩ.
- 3.3V TARGET LDO
- Negative Output (Vout_neg = -14V):
  - Given:
    - R1 = 1.3 MΩ
    - Calculated R2 ≈ 136.3 kΩ
  - Nearest E96 Standard Value:
    - R2 = 137 kΩ
  - Resulting Output Voltage:
    - Vout = 1.213 × (1 + R1 / R2)
    - Vout = 1.213 × (1 + 1300 / 137) ≈ 14.01 V
  - Final Pair:
    - R1 = 1.3 MΩ
    - R2 = 137 kΩ
  
  Negative Channel:
  - Target VOUTN = -14 V, 
  adjustment range: -12.6 V to -15.4 V.
  - Configuration:
    - R2N = 137 kΩ (fixed).
    - R1N = 1.2 MΩ (fixed) + 250 kΩ (trimmer).
  - Adjustment Range:
    - R1N = 1.2 MΩ to 1.45 MΩ.
- 2.5V VREF
- TESTPOINTS POWER